# EAGLE design control (EAGLE 9.6.2)

## Sheet 1 of 3: MCU
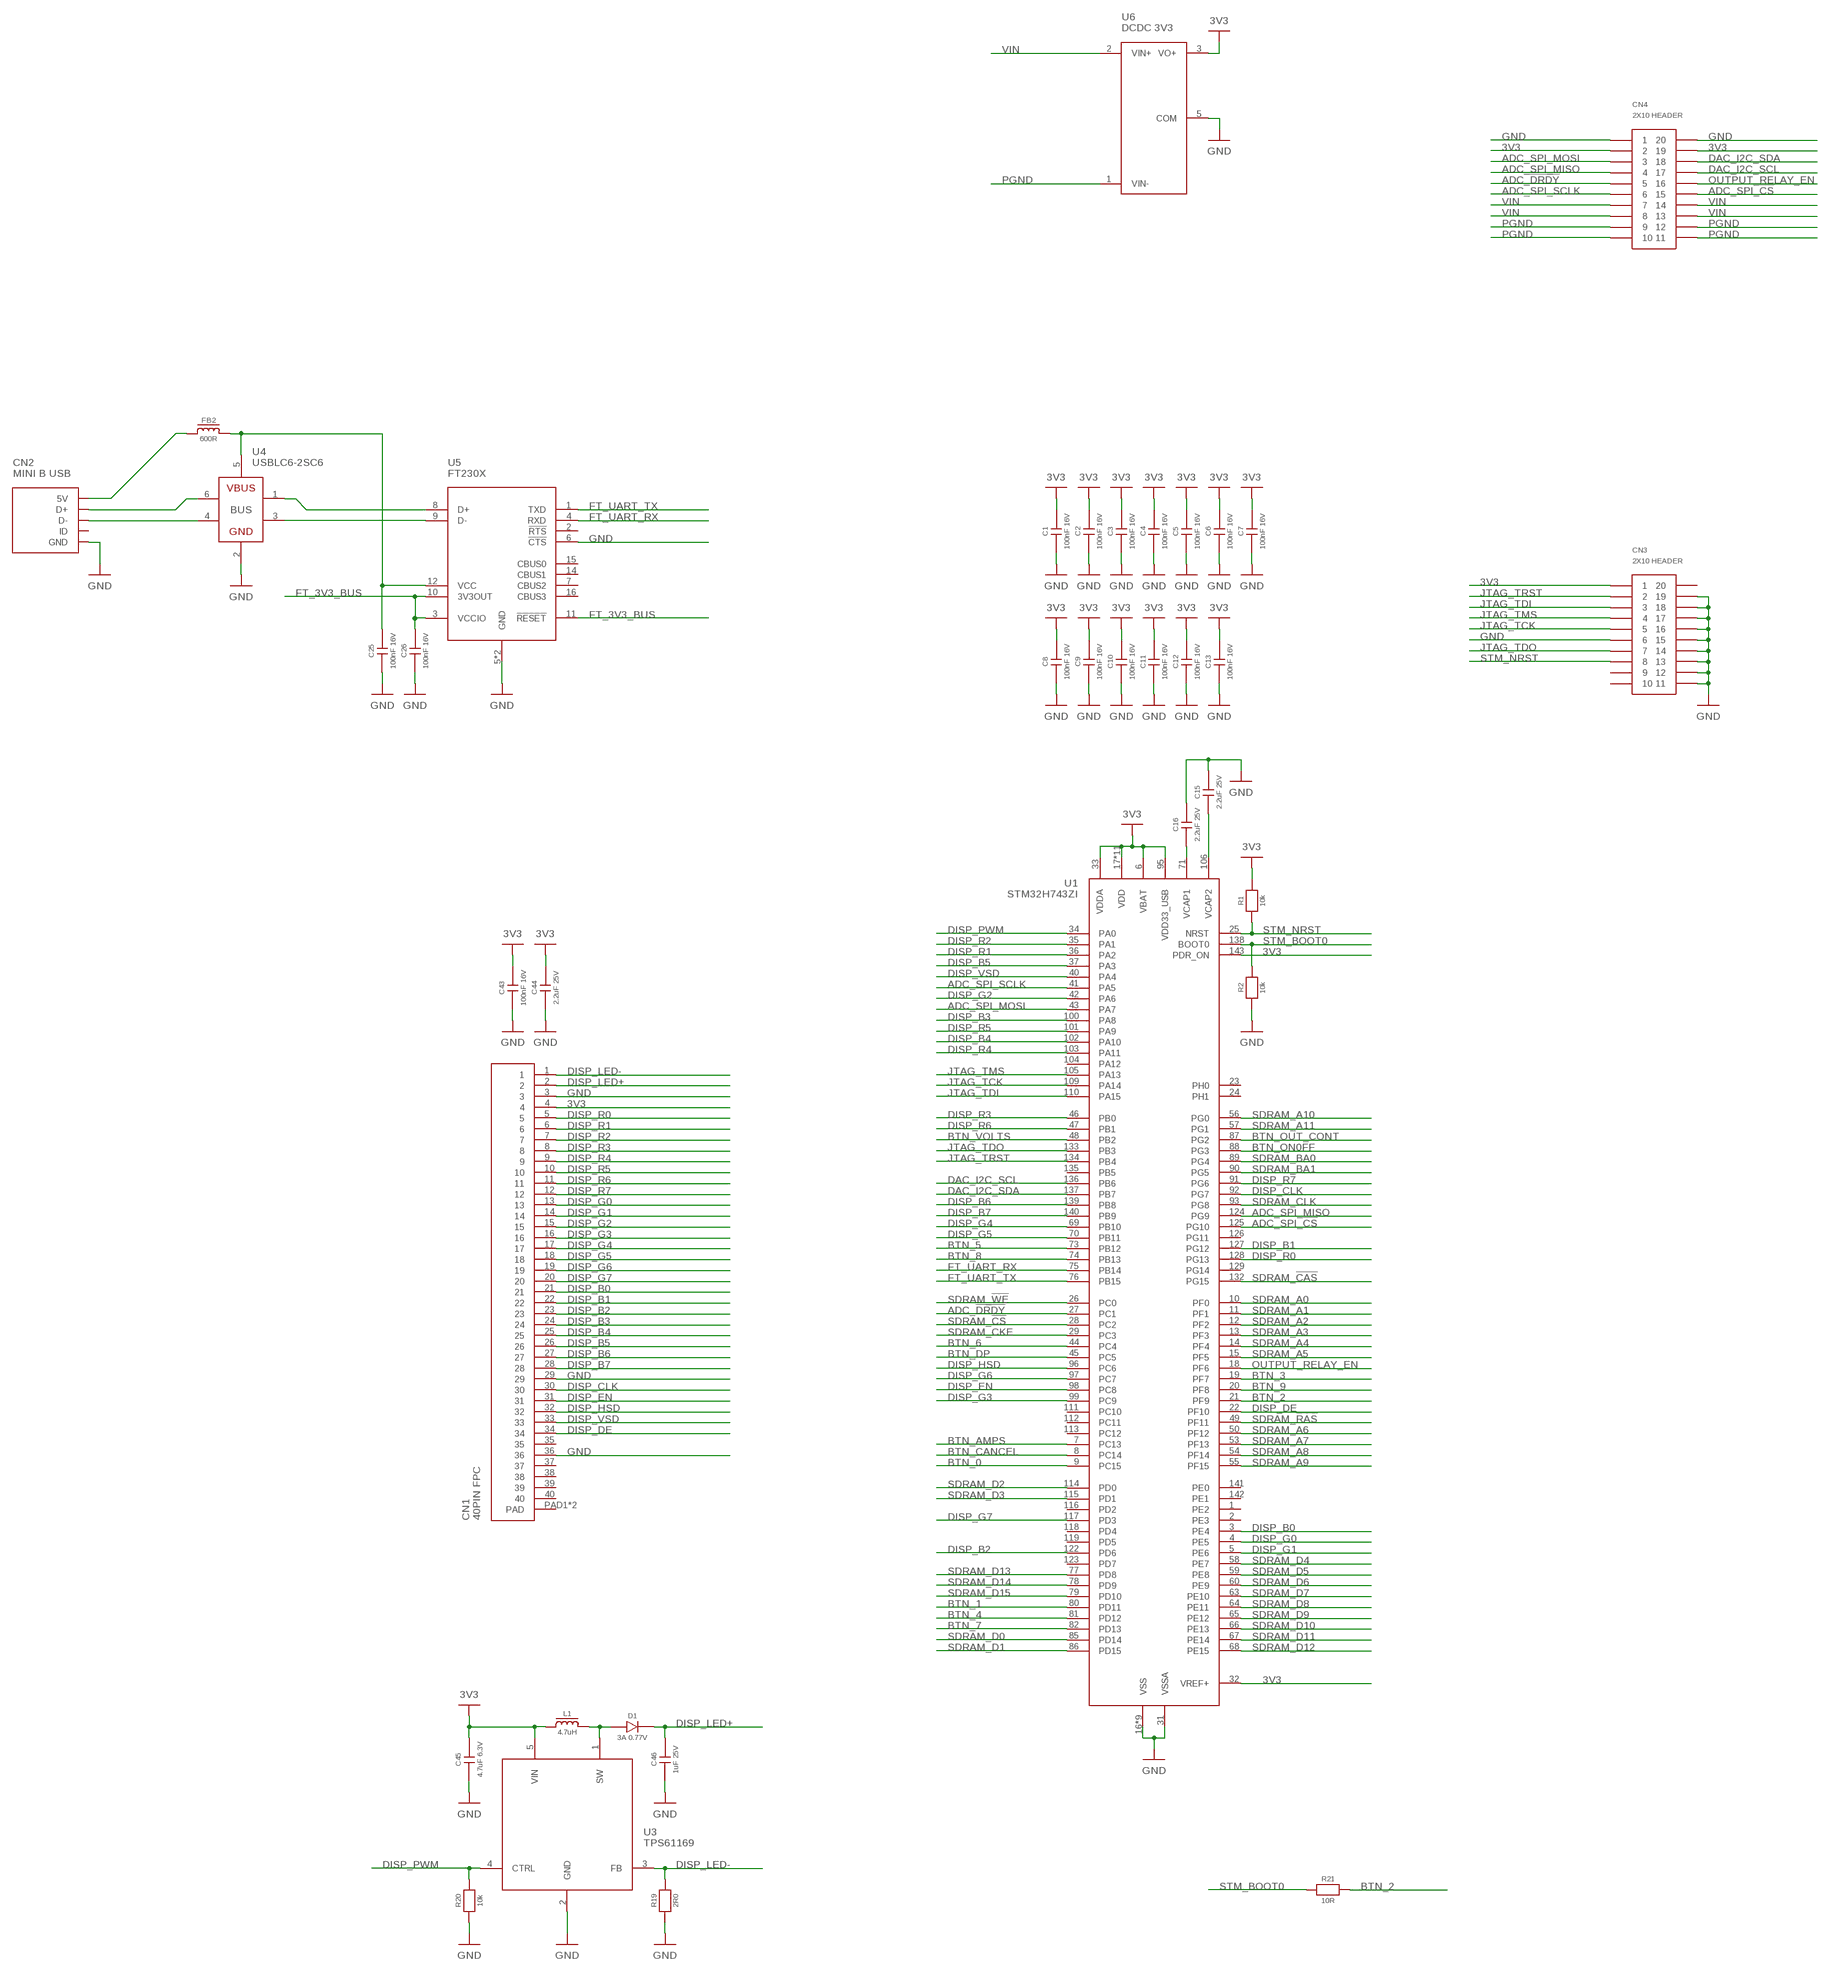
[diagram p0: schematic, sheet 1]

### Parts
C1  100nF 16V  CL10B104KO8WPNC  [0603]
C2  100nF 16V  CL10B104KO8WPNC  [0603]
C3  100nF 16V  CL10B104KO8WPNC  [0603]
C4  100nF 16V  CL10B104KO8WPNC  [0603]
C5  100nF 16V  CL10B104KO8WPNC  [0603]
C6  100nF 16V  CL10B104KO8WPNC  [0603]
C7  100nF 16V  CL10B104KO8WPNC  [0603]
C8  100nF 16V  CL10B104KO8WPNC  [0603]
C9  100nF 16V  CL10B104KO8WPNC  [0603]
C10  100nF 16V  CL10B104KO8WPNC  [0603]
C11  100nF 16V  CL10B104KO8WPNC  [0603]
C12  100nF 16V  CL10B104KO8WPNC  [0603]
C13  100nF 16V  CL10B104KO8WPNC  [0603]
C15  2.2uF 25V  GRM188R61E225KA12D  [0603]
C16  2.2uF 25V  GRM188R61E225KA12D  [0603]
C25  100nF 16V  CL10B104KO8WPNC  [0603]
C26  100nF 16V  CL10B104KO8WPNC  [0603]
C43  100nF 16V  CL10B104KO8WPNC  [0603]
C44  2.2uF 25V  GRM188R61E225KA12D  [0603]
C45  4.7uF 6.3V  CL10B475KQ8NQNC  [0603]
C46  1uF 25V  CL10A105KA8NNNC  [0603]
CN1  40PIN FPC  XF2M40151A  [XF2M40151A]
CN2  MINI B USB  MUSB-05-S-B-SM-A  [MUSB-05-S-B-SM-A]
CN3  2X10 HEADER  2X10_HEADER  [2X10PIN_HEADER]
CN4  2X10 HEADER  2X10_HEADER  [2X10PIN_HEADER]
D1  3A 0.77V  PMEG10030ELP  [SOD128]
FB2  600R  742792651  [0603]
L1  4.7uH  SRN6045TA-4R7M  [SRN6045]
R1  10k  ERJ3EKF1002V  [0603]
R2  10k  ERJ3EKF1002V  [0603]
R19  2R0  CRCW12062R00FNEA  [1206]
R20  10k  ERJ3EKF1002V  [0603]
R21  10R  ERJ3EKF10R0V  [0603]
U1  STM32H743ZI  [QFP144]
U3  TPS61169  TPS61169DCKR  [SOT23-5]
U4  USBLC6-2SC6  [SOT23-6]
U5  FT230X  FT230XS  [SSOP16-4MM]
U6  DCDC 3V3  PDQE15-Q24-S3-D  [PDQE10]

### Nets
3V3: C1.2 C2.2 C3.2 C4.2 C5.2 C6.2 C7.2 C8.2 C9.2 C10.2 C11.2 C12.2 C13.2 C43.2 C44.2 C45.2 CN1.4 CN3.1 CN4.2 CN4.19 L1.1 R1.2 U1.6(VBAT) U1.17(VDD) U1.30(VDD) U1.32(VREF+) U1.33(VDDA) U1.39(VDD) U1.52(VDD) U1.62(VDD) U1.72(VDD) U1.84(VDD) U1.95(VDD33_USB) U1.108(VDD) U1.121(VDD) U1.131(VDD) U1.143(PDR_ON) U1.144(VDD) U3.5(VIN) U6.3(VO+) ; also sheet 3
ADC_!DRDY: CN4.5 U1.27(PC1)
ADC_SPI_!CS: CN4.15 U1.125(PG10)
ADC_SPI_MISO: CN4.4 U1.124(PG9)
ADC_SPI_MOSI: CN4.3 U1.43(PA7)
ADC_SPI_SCLK: CN4.6 U1.41(PA5)
BTN_0: U1.9(PC15) ; also sheet 3
BTN_1: U1.80(PD11) ; also sheet 3
BTN_2: R21.2 U1.21(PF9) ; also sheet 3
BTN_3: U1.19(PF7) ; also sheet 3
BTN_4: U1.81(PD12) ; also sheet 3
BTN_5: U1.73(PB12) ; also sheet 3
BTN_6: U1.44(PC4) ; also sheet 3
BTN_7: U1.82(PD13) ; also sheet 3
BTN_8: U1.74(PB13) ; also sheet 3
BTN_9: U1.20(PF8) ; also sheet 3
BTN_AMPS: U1.7(PC13) ; also sheet 3
BTN_CANCEL: U1.8(PC14) ; also sheet 3
BTN_DP: U1.45(PC5) ; also sheet 3
BTN_ON0FF: U1.88(PG3) ; also sheet 3
BTN_OUT_CONT: U1.87(PG2) ; also sheet 3
BTN_VOLTS: U1.48(PB2) ; also sheet 3
DAC_I2C_SCL: CN4.17 U1.136(PB6)
DAC_I2C_SDA: CN4.18 U1.137(PB7)
DISP_B0: CN1.21 U1.3(PE4)
DISP_B1: CN1.22 U1.127(PG12)
DISP_B2: CN1.23 U1.122(PD6)
DISP_B3: CN1.24 U1.100(PA8)
DISP_B4: CN1.25 U1.102(PA10)
DISP_B5: CN1.26 U1.37(PA3)
DISP_B6: CN1.27 U1.139(PB8)
DISP_B7: CN1.28 U1.140(PB9)
DISP_CLK: CN1.30 U1.92(PG7)
DISP_DE: CN1.34 U1.22(PF10)
DISP_EN: CN1.31 U1.98(PC8)
DISP_G0: CN1.13 U1.4(PE5)
DISP_G1: CN1.14 U1.5(PE6)
DISP_G2: CN1.15 U1.42(PA6)
DISP_G3: CN1.16 U1.99(PC9)
DISP_G4: CN1.17 U1.69(PB10)
DISP_G5: CN1.18 U1.70(PB11)
DISP_G6: CN1.19 U1.97(PC7)
DISP_G7: CN1.20 U1.117(PD3)
DISP_HSD: CN1.32 U1.96(PC6)
DISP_LED+: C46.2 CN1.2 D1.K
DISP_LED-: CN1.1 R19.2 U3.3(FB)
DISP_PWM: R20.2 U1.34(PA0) U3.4(CTRL)
DISP_R0: CN1.5 U1.128(PG13)
DISP_R1: CN1.6 U1.36(PA2)
DISP_R2: CN1.7 U1.35(PA1)
DISP_R3: CN1.8 U1.46(PB0)
DISP_R4: CN1.9 U1.103(PA11)
DISP_R5: CN1.10 U1.101(PA9)
DISP_R6: CN1.11 U1.47(PB1)
DISP_R7: CN1.12 U1.91(PG6)
DISP_VSD: CN1.33 U1.40(PA4)
FT_3V3_BUS: C26.2 U5.3(VCCIO) U5.10(3V3OUT) U5.11(!RESET)
FT_UART_RX: U1.75(PB14) U5.4(RXD)
FT_UART_TX: U1.76(PB15) U5.1(TXD)
GND: C1.1 C2.1 C3.1 C4.1 C5.1 C6.1 C7.1 C8.1 C9.1 C10.1 C11.1 C12.1 C13.1 C15.2 C16.2 C25.1 C26.1 C43.1 C44.1 C45.1 C46.1 CN1.3 CN1.29 CN1.36 CN2.GND CN2.SHIELD1(GND) CN2.SHIELD2(GND) CN2.SHIELD3(GND) CN2.SHIELD4(GND) CN3.6 CN3.11 CN3.12 CN3.13 CN3.14 CN3.15 CN3.16 CN3.17 CN3.18 CN3.19 CN4.1 CN4.20 R2.1 R19.1 R20.1 U1.16(VSS) U1.31(VSSA) U1.38(VSS) U1.51(VSS) U1.61(VSS) U1.83(VSS) U1.94(VSS) U1.107(VSS) U1.120(VSS) U1.130(VSS) U3.2(GND) U4.2(GND) U5.5(GND) U5.6(!CTS) U5.13(GND) U6.5(COM) ; also sheet 3
JTAG_TCK: CN3.5 U1.109(PA14)
JTAG_TDI: CN3.3 U1.110(PA15)
JTAG_TDO: CN3.7 U1.133(PB3)
JTAG_TMS: CN3.4 U1.105(PA13)
JTAG_TRST: CN3.2 U1.134(PB4)
N$1: C16.1 U1.71(VCAP1)
N$2: C15.1 U1.106(VCAP2)
N$41: CN2.D- U4.4(D-OUT)
N$42: CN2.D+ U4.6(D+_OUT)
N$43: U4.3(D-_IN) U5.9(D-)
N$44: U4.1(D+_IN) U5.8(D+)
N$45: CN2.VCC(5V) FB2.1
N$46: C25.2 FB2.2 U4.5(VBUS) U5.12(VCC)
N$86: D1.A L1.2 U3.1(SW)
OUTPUT_RELAY_EN: CN4.16 U1.18(PF6)
PGND: CN4.9 CN4.10 CN4.11 CN4.12 U6.1(VIN-)
SDRAM_!CAS: U1.132(PG15)
SDRAM_!CS: U1.28(PC2)
SDRAM_!RAS: U1.49(PF11)
SDRAM_!WE: U1.26(PC0)
SDRAM_A0: U1.10(PF0)
SDRAM_A1: U1.11(PF1)
SDRAM_A2: U1.12(PF2)
SDRAM_A3: U1.13(PF3)
SDRAM_A4: U1.14(PF4)
SDRAM_A5: U1.15(PF5)
SDRAM_A6: U1.50(PF12)
SDRAM_A7: U1.53(PF13)
SDRAM_A8: U1.54(PF14)
SDRAM_A9: U1.55(PF15)
SDRAM_A10: U1.56(PG0)
SDRAM_A11: U1.57(PG1)
SDRAM_BA0: U1.89(PG4)
SDRAM_BA1: U1.90(PG5)
SDRAM_CKE: U1.29(PC3)
SDRAM_CLK: U1.93(PG8)
SDRAM_D0: U1.85(PD14)
SDRAM_D1: U1.86(PD15)
SDRAM_D2: U1.114(PD0)
SDRAM_D3: U1.115(PD1)
SDRAM_D4: U1.58(PE7)
SDRAM_D5: U1.59(PE8)
SDRAM_D6: U1.60(PE9)
SDRAM_D7: U1.63(PE10)
SDRAM_D8: U1.64(PE11)
SDRAM_D9: U1.65(PE12)
SDRAM_D10: U1.66(PE13)
SDRAM_D11: U1.67(PE14)
SDRAM_D12: U1.68(PE15)
SDRAM_D13: U1.77(PD8)
SDRAM_D14: U1.78(PD9)
SDRAM_D15: U1.79(PD10)
STM_BOOT0: R2.2 R21.1 U1.138(BOOT0)
STM_NRST: CN3.8 R1.1 U1.25(NRST)
VIN: CN4.7 CN4.8 CN4.13 CN4.14 U6.2(VIN+)
Unconnected: CN1.35 CN1.37 CN1.38 CN1.39 CN1.40 CN1.PAD1(PAD) CN1.PAD2(PAD) CN2.ID CN3.9 CN3.10 CN3.20 U1.1(PE2) U1.2(PE3) U1.23(PH0) U1.24(PH1) U1.104(PA12) U1.111(PC10) U1.112(PC11) U1.113(PC12) U1.116(PD2) U1.118(PD4) U1.119(PD5) U1.123(PD7) U1.126(PG11) U1.129(PG14) U1.135(PB5) U1.141(PE0) U1.142(PE1) U5.2(!RTS) U5.7(CBUS2) U5.14(CBUS1) U5.15(CBUS0) U5.16(CBUS3)

## Sheet 2 of 3: MECH
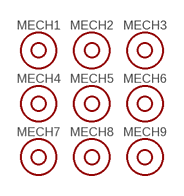
[diagram p1: schematic, sheet 2]

### Parts
MECH1  6mm x 3mm  MOUNTHOLE  [MOUNTHOLE_6X3]
MECH2  6mm x 3mm  MOUNTHOLE  [MOUNTHOLE_6X3]
MECH3  6mm x 3mm  MOUNTHOLE  [MOUNTHOLE_6X3]
MECH4  6mm x 3mm  MOUNTHOLE  [MOUNTHOLE_6X3]
MECH5  6mm x 3mm  MOUNTHOLE  [MOUNTHOLE_6X3]
MECH6  6mm x 3mm  MOUNTHOLE  [MOUNTHOLE_6X3]
MECH7  6mm x 3mm  MOUNTHOLE  [MOUNTHOLE_6X3]
MECH8  6mm x 3mm  MOUNTHOLE  [MOUNTHOLE_6X3]
MECH9  6mm x 3mm  MOUNTHOLE  [MOUNTHOLE_6X3]

## Sheet 3 of 3: BUTTONS
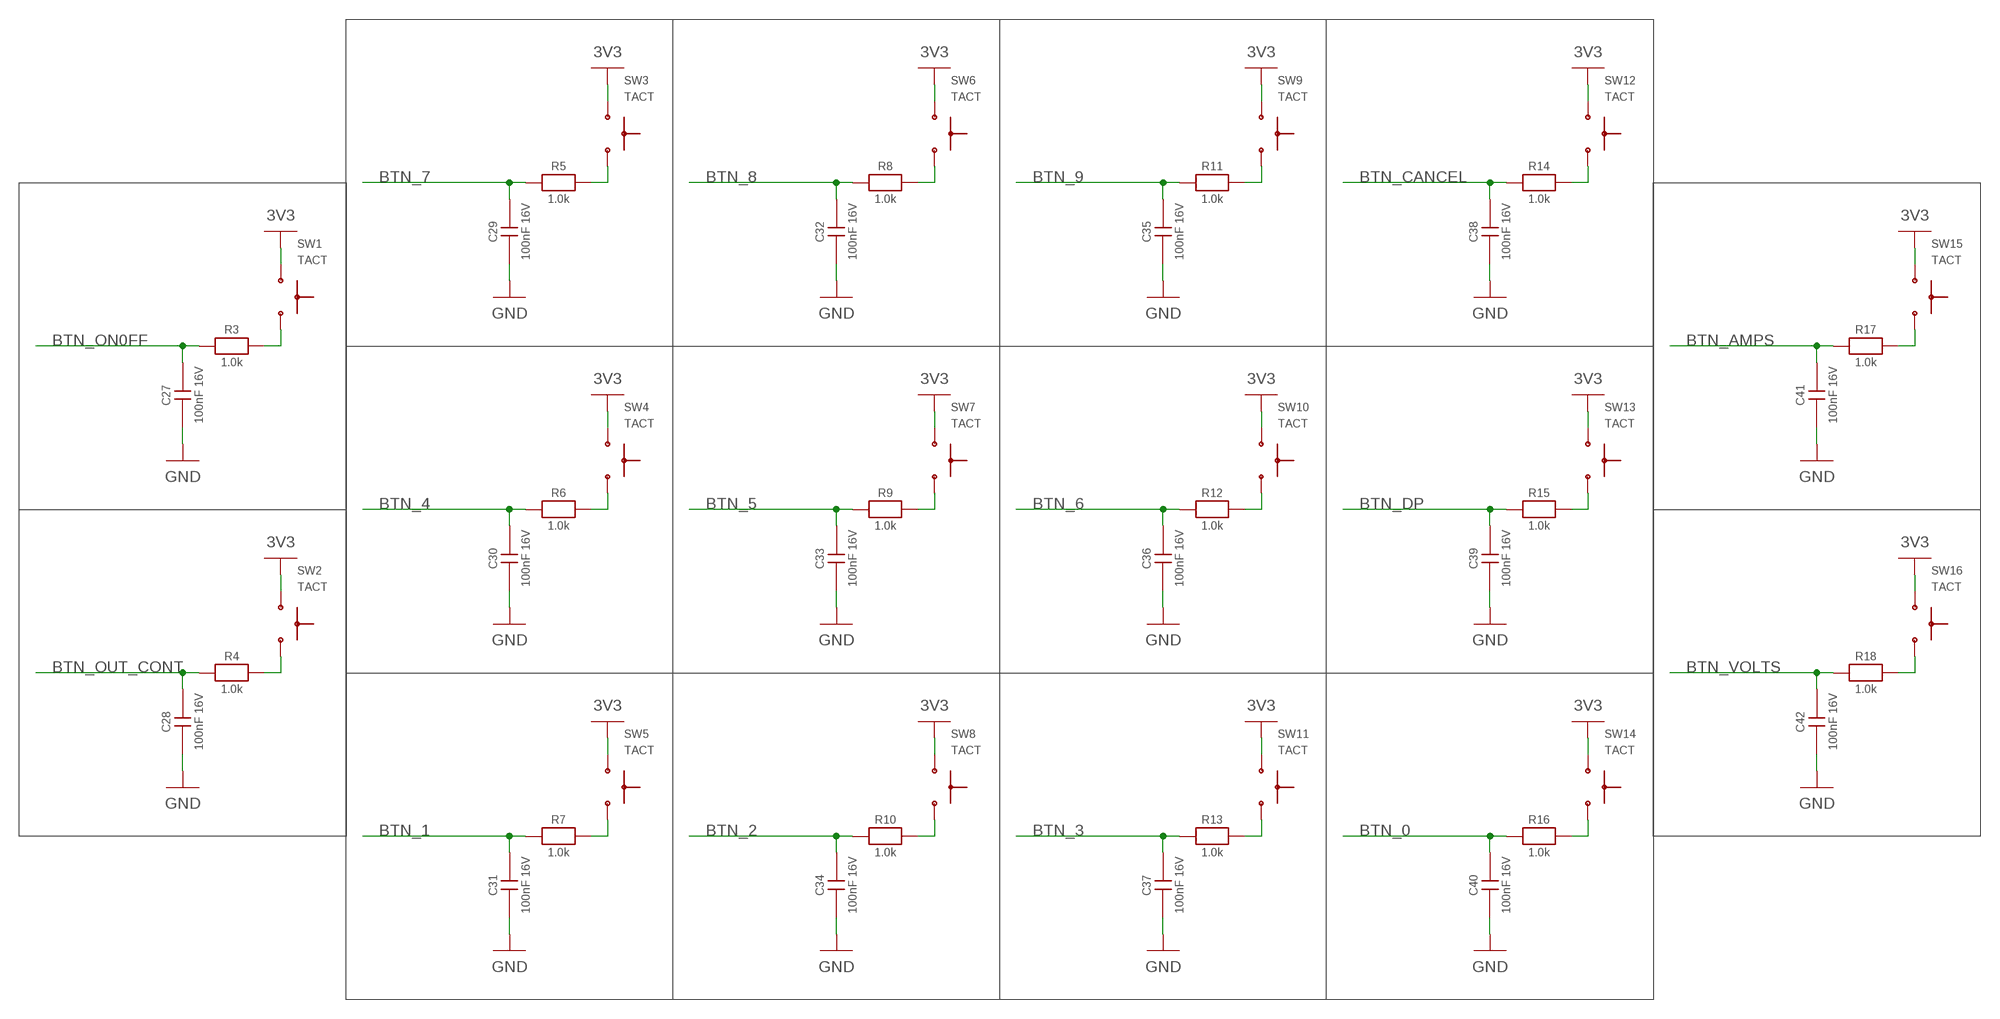
[diagram p2: schematic, sheet 3]

### Parts
C27  100nF 16V  CL10B104KO8WPNC  [0603]
C28  100nF 16V  CL10B104KO8WPNC  [0603]
C29  100nF 16V  CL10B104KO8WPNC  [0603]
C30  100nF 16V  CL10B104KO8WPNC  [0603]
C31  100nF 16V  CL10B104KO8WPNC  [0603]
C32  100nF 16V  CL10B104KO8WPNC  [0603]
C33  100nF 16V  CL10B104KO8WPNC  [0603]
C34  100nF 16V  CL10B104KO8WPNC  [0603]
C35  100nF 16V  CL10B104KO8WPNC  [0603]
C36  100nF 16V  CL10B104KO8WPNC  [0603]
C37  100nF 16V  CL10B104KO8WPNC  [0603]
C38  100nF 16V  CL10B104KO8WPNC  [0603]
C39  100nF 16V  CL10B104KO8WPNC  [0603]
C40  100nF 16V  CL10B104KO8WPNC  [0603]
C41  100nF 16V  CL10B104KO8WPNC  [0603]
C42  100nF 16V  CL10B104KO8WPNC  [0603]
R3  1.0k  ERJ3EKF1001V  [0603]
R4  1.0k  ERJ3EKF1001V  [0603]
R5  1.0k  ERJ3EKF1001V  [0603]
R6  1.0k  ERJ3EKF1001V  [0603]
R7  1.0k  ERJ3EKF1001V  [0603]
R8  1.0k  ERJ3EKF1001V  [0603]
R9  1.0k  ERJ3EKF1001V  [0603]
R10  1.0k  ERJ3EKF1001V  [0603]
R11  1.0k  ERJ3EKF1001V  [0603]
R12  1.0k  ERJ3EKF1001V  [0603]
R13  1.0k  ERJ3EKF1001V  [0603]
R14  1.0k  ERJ3EKF1001V  [0603]
R15  1.0k  ERJ3EKF1001V  [0603]
R16  1.0k  ERJ3EKF1001V  [0603]
R17  1.0k  ERJ3EKF1001V  [0603]
R18  1.0k  ERJ3EKF1001V  [0603]
SW1  TACT  TL1100DF160Q  [TL1100DF160Q]
SW2  TACT  TL1100DF160Q  [TL1100DF160Q]
SW3  TACT  TL1100DF160Q  [TL1100DF160Q]
SW4  TACT  TL1100DF160Q  [TL1100DF160Q]
SW5  TACT  TL1100DF160Q  [TL1100DF160Q]
SW6  TACT  TL1100DF160Q  [TL1100DF160Q]
SW7  TACT  TL1100DF160Q  [TL1100DF160Q]
SW8  TACT  TL1100DF160Q  [TL1100DF160Q]
SW9  TACT  TL1100DF160Q  [TL1100DF160Q]
SW10  TACT  TL1100DF160Q  [TL1100DF160Q]
SW11  TACT  TL1100DF160Q  [TL1100DF160Q]
SW12  TACT  TL1100DF160Q  [TL1100DF160Q]
SW13  TACT  TL1100DF160Q  [TL1100DF160Q]
SW14  TACT  TL1100DF160Q  [TL1100DF160Q]
SW15  TACT  TL1100DF160Q  [TL1100DF160Q]
SW16  TACT  TL1100DF160Q  [TL1100DF160Q]

### Nets
3V3: SW1.1 SW1.3 SW2.1 SW2.3 SW3.1 SW3.3 SW4.1 SW4.3 SW5.1 SW5.3 SW6.1 SW6.3 SW7.1 SW7.3 SW8.1 SW8.3 SW9.1 SW9.3 SW10.1 SW10.3 SW11.1 SW11.3 SW12.1 SW12.3 SW13.1 SW13.3 SW14.1 SW14.3 SW15.1 SW15.3 SW16.1 SW16.3 ; also sheet 1
BTN_0: C40.2 R16.1 ; also sheet 1
BTN_1: C31.2 R7.1 ; also sheet 1
BTN_2: C34.2 R10.1 ; also sheet 1
BTN_3: C37.2 R13.1 ; also sheet 1
BTN_4: C30.2 R6.1 ; also sheet 1
BTN_5: C33.2 R9.1 ; also sheet 1
BTN_6: C36.2 R12.1 ; also sheet 1
BTN_7: C29.2 R5.1 ; also sheet 1
BTN_8: C32.2 R8.1 ; also sheet 1
BTN_9: C35.2 R11.1 ; also sheet 1
BTN_AMPS: C41.2 R17.1 ; also sheet 1
BTN_CANCEL: C38.2 R14.1 ; also sheet 1
BTN_DP: C39.2 R15.1 ; also sheet 1
BTN_ON0FF: C27.2 R3.1 ; also sheet 1
BTN_OUT_CONT: C28.2 R4.1 ; also sheet 1
BTN_VOLTS: C42.2 R18.1 ; also sheet 1
GND: C27.1 C28.1 C29.1 C30.1 C31.1 C32.1 C33.1 C34.1 C35.1 C36.1 C37.1 C38.1 C39.1 C40.1 C41.1 C42.1 ; also sheet 1
N$48: R3.2 SW1.2 SW1.4
N$50: R4.2 SW2.2 SW2.4
N$52: R5.2 SW3.2 SW3.4
N$54: R6.2 SW4.2 SW4.4
N$56: R7.2 SW5.2 SW5.4
N$58: R8.2 SW6.2 SW6.4
N$60: R9.2 SW7.2 SW7.4
N$62: R10.2 SW8.2 SW8.4
N$64: R11.2 SW9.2 SW9.4
N$66: R12.2 SW10.2 SW10.4
N$68: R13.2 SW11.2 SW11.4
N$70: R14.2 SW12.2 SW12.4
N$72: R15.2 SW13.2 SW13.4
N$74: R16.2 SW14.2 SW14.4
N$76: R17.2 SW15.2 SW15.4
N$78: R18.2 SW16.2 SW16.4

## Library data of the parts
C1-C13 C25-C43 = CAPACITORS:CL10B104KO8WPNC: 100nF 16V X7R 10% 0603 MLCC; DIGIKEY: 1276-6582-1-ND; HEIGHT: 1; PRICE_PER: 0.08
C15 C16 C44 = CAPACITORS:GRM188R61E225KA12D: 2.2uF 25V X5R 10% 0603 MLCC.; DIGIKEY: 490-10731-1-ND; HEIGHT: 1; PRICE_PER: 0.14
C45 = CAPACITORS:CL10B475KQ8NQNC: 4.7uF 6.3V X7R 10% 0603 MLCC.; DIGIKEY: CL10B475KQ8NQNC; HEIGHT: 1; PRICE_PER: 013
C46 = CAPACITORS:CL10A105KA8NNNC: 1uF 25V X5R 10% 0603 MLCC.; DIGIKEY: 1276-1102-1-ND; HEIGHT: 1; PRICE_PER: 0.08
CN1 = CONNECTORs:XF2M40151A: FFC / FPC Board Connector, ZIF, Surface Mount, Plug, 40 Contacts, Top, Bottom, 0.5 mm; DIGIKEY: OR729CT-ND; HEIGHT: 2; PRICE_PER: 2.07
CN2 = CONNECTORs:MUSB-05-S-B-SM-A: 5 pin, SMD, mini USB connector.; DIGIKEY: SAM8841-ND; HEIGHT: 4; PRICE_PER: 1.11
CN3 CN4 = CONNECTORs:2X10_HEADER: A 2 row, 10 column, 20 pin 0.1" header.; DIGIKEY: 2057-PH2-20-UA-ND; HEIGHT: 10; PRICE_PER: 0.2
D1 = DIODES:PMEG10030ELP: Schottky Rectifier, 100 V, 3 A, Single, SOD-128, 2 Pins, 770 mV; DIGIKEY: 1727-2397-1-ND; HEIGHT: 3; PRICE_PER: 0.37
FB2 = INDUCTORS:742792651: Ferrite Bead 600R at 100MHz 0603.; DIGIKEY: 732-1593-1-ND; HEIGHT: 1; PRICE_PER: 0.13
L1 = INDUCTORS:SRN6045TA-4R7M: Surface Mount Power Inductor, AEC-Q200, SRN6045TA Series, 4.7 µH, 4.5 A, 6.8 A, Semishielded; DIGIKEY: SRN6045TA-4R7MCT-ND; HEIGHT: 5; PRICE_PER: 0.44
MECH1-MECH9 = MISC:MOUNTHOLE: Mechanical mounting hole.
R1 R2 R20 = r_0603:ERJ3EKF1002V: 10000 10k 0603 0.1W 1% thick film resistor.; DIGIKEY: P10.0KHCT-ND; PRICE_PER: 0.10000
R3-R18 = r_0603:ERJ3EKF1001V: 1000 1.0k 0603 0.1W 1% thick film resistor.; DIGIKEY: P1.00KHCT-ND; PRICE_PER: 0.10000
R19 = RESISTORS:CRCW12062R00FNEA: 2 2R0 1206 0.25W 1% thick film resistor; DIGIKEY: 311-2.0ERCT-ND; HEIGHT: 0.65; PRICE_PER: 0.09
R21 = r_0603:ERJ3EKF10R0V: 10 10R 0603 0.1W 1% thick film resistor.; DIGIKEY: P10.0HCT-ND; PRICE_PER: 0.10000
SW1-SW16 = ELECTROMECH:TL1100DF160Q: Tactile Switch SPST-NO Top Actuated Through Hole; DIGIKEY: EG1023-ND; HEIGHT: 4.3; PRICE_PER: 0.35
U1 = ICs:STM32H743ZI: ARM® Cortex®-M7 STM32H7 Microcontroller IC 32-Bit 480MHz 2MB (2M x 8) FLASH 144-LQFP (20x20); DIGIKEY: 497-17721-ND; HEIGHT: 2; PRICE_PER: 11.56
U3 = ICs:TPS61169: 9 38-V High Current-Boost WLED Driver with PWM Control; DIGIKEY: 296-40821-1-ND; HEIGHT: 2; PRICE_PER: 0.7
U4 = ICs:USBLC6-2SC6: Very low capacitance ESD protection; DIGIKEY: 497-11882-1-ND; HEIGHT: 1.5; PRICE_PER: 0.38
U5 = ICs:FT230X: FTDI FT230XS USB Interface, Transceiver, USB 2.0, 2.97 V, 5.5 V, SSOP, 16; DIGIKEY: 768-1135-1-ND; HEIGHT: 1.5; PRICE_PER: 1.65
U6 = ICs:PDQE15-Q24-S3-D: Isolated Module DC DC Converter 1 Output 3.3V 4A 9V - 36V Input; DIGIKEY: 102-6252-ND; HEIGHT: 12; PRICE_PER: 14.88

## Board
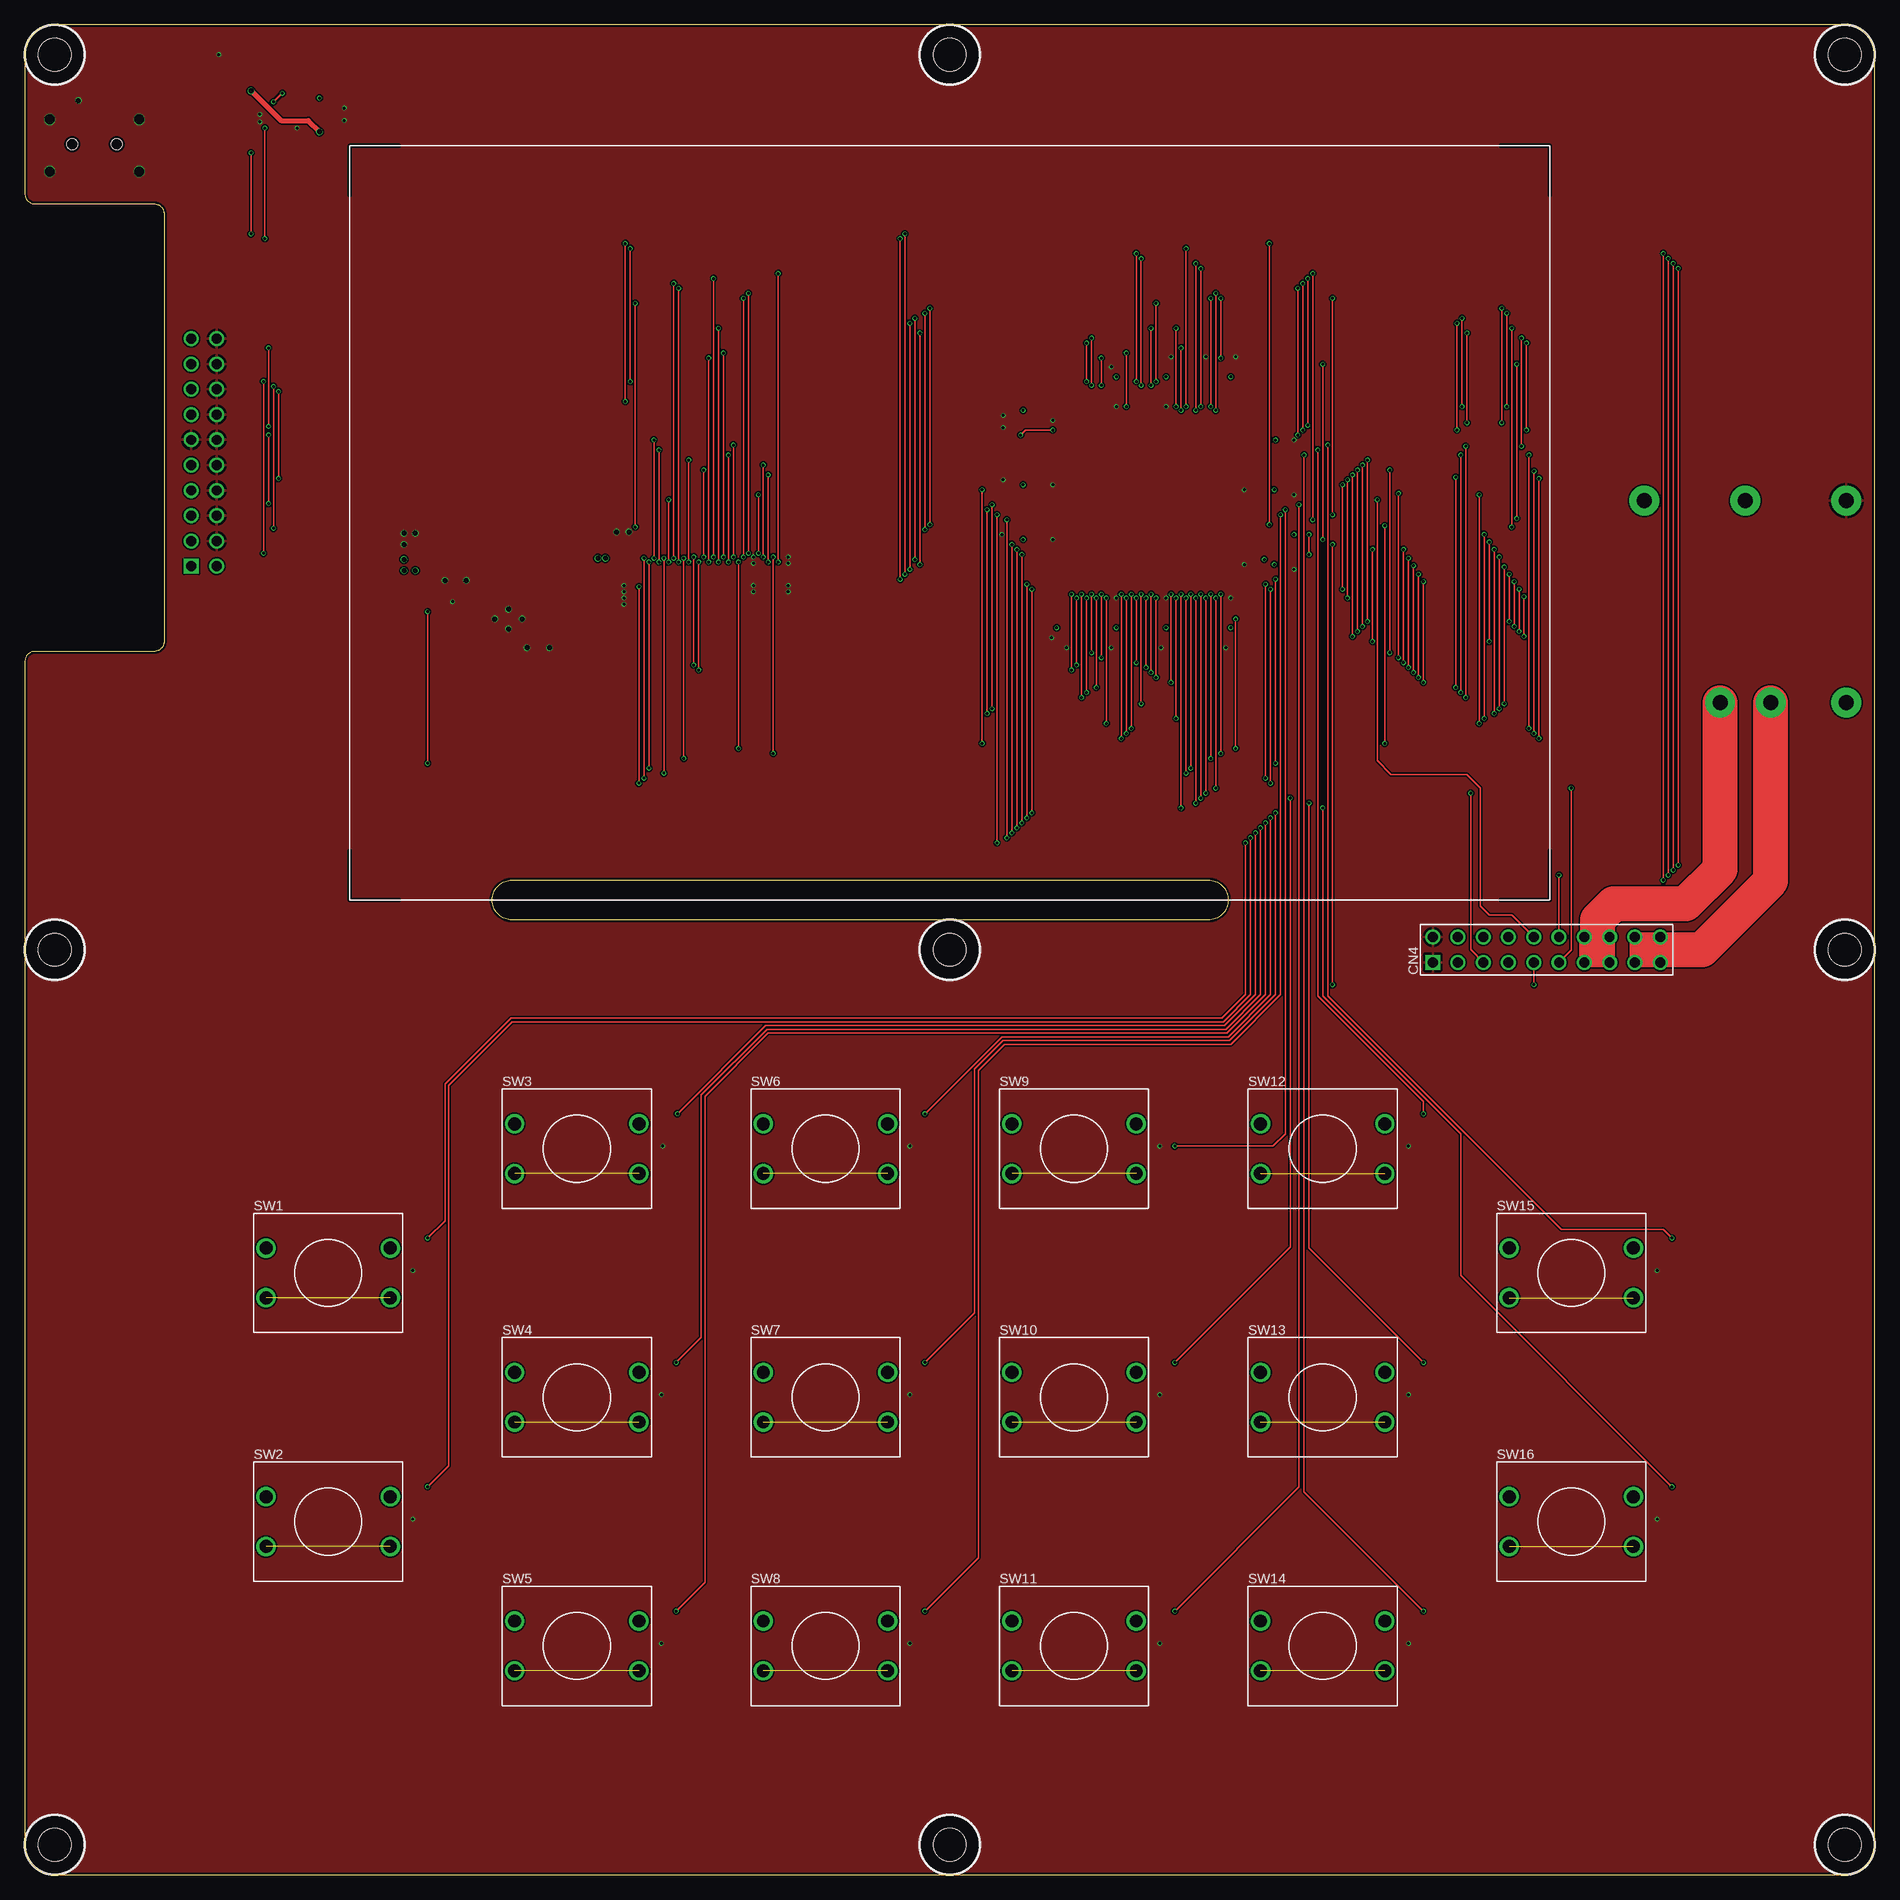
[diagram p3: board, top side]
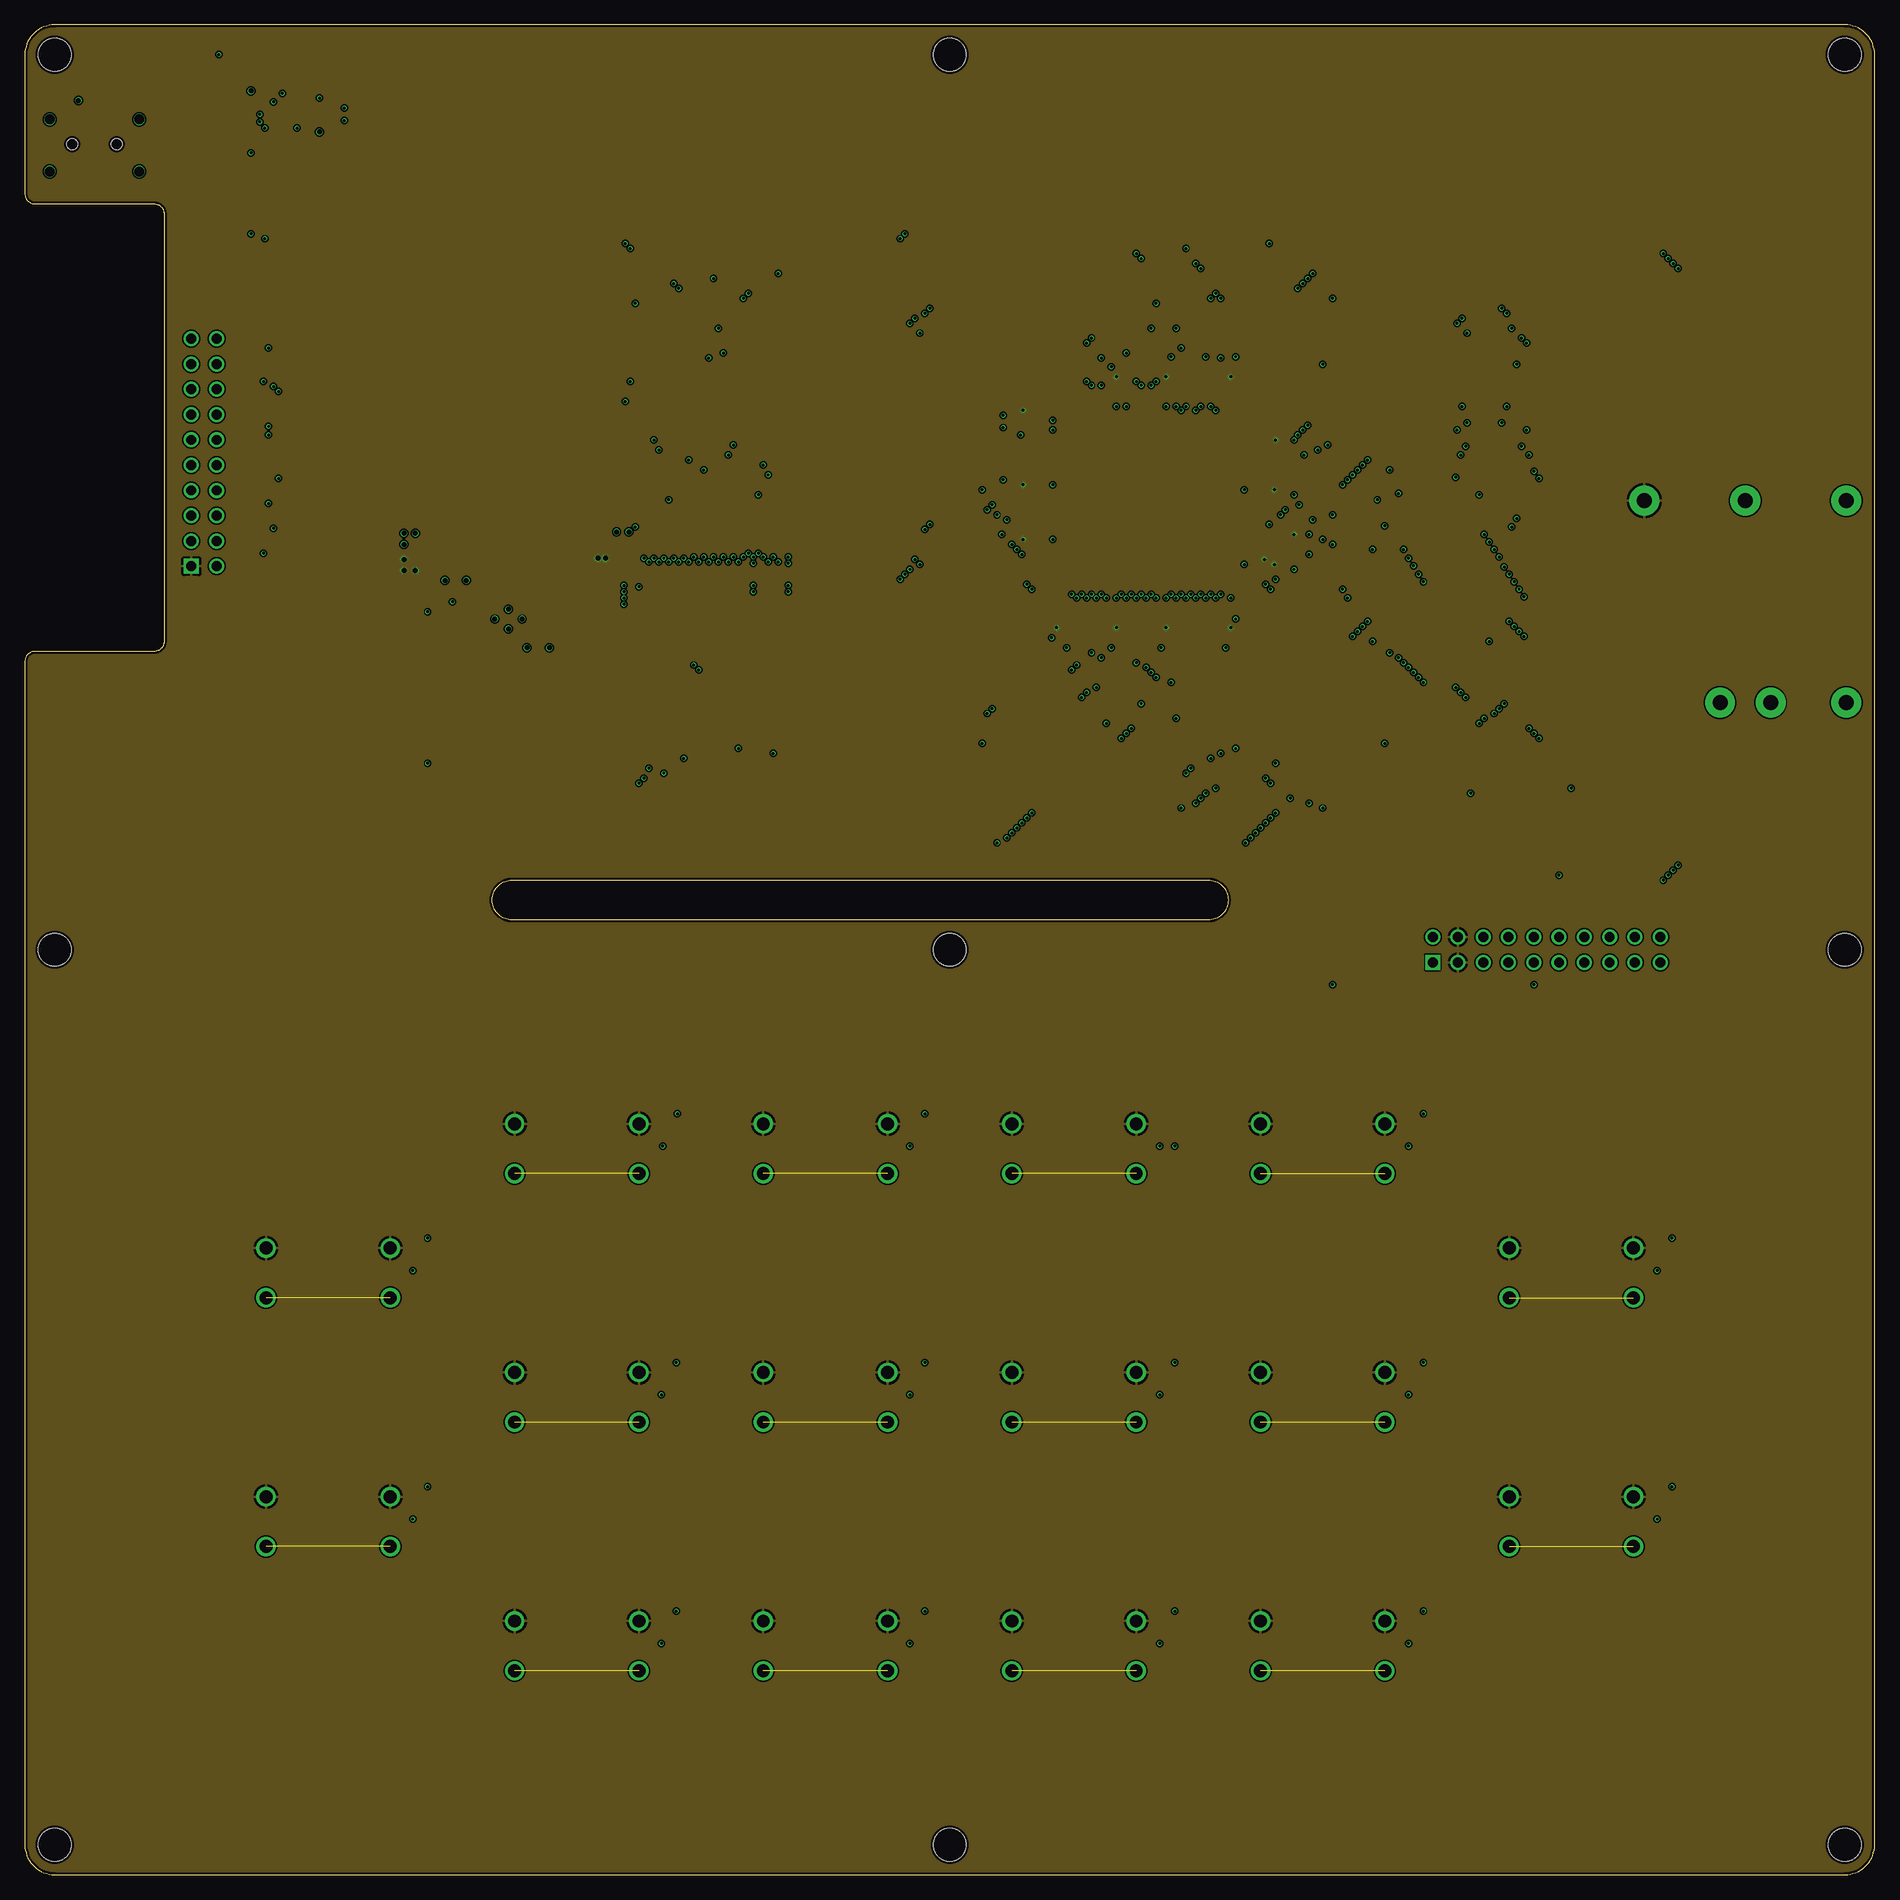
[diagram p4: board, inner layer 3V3]
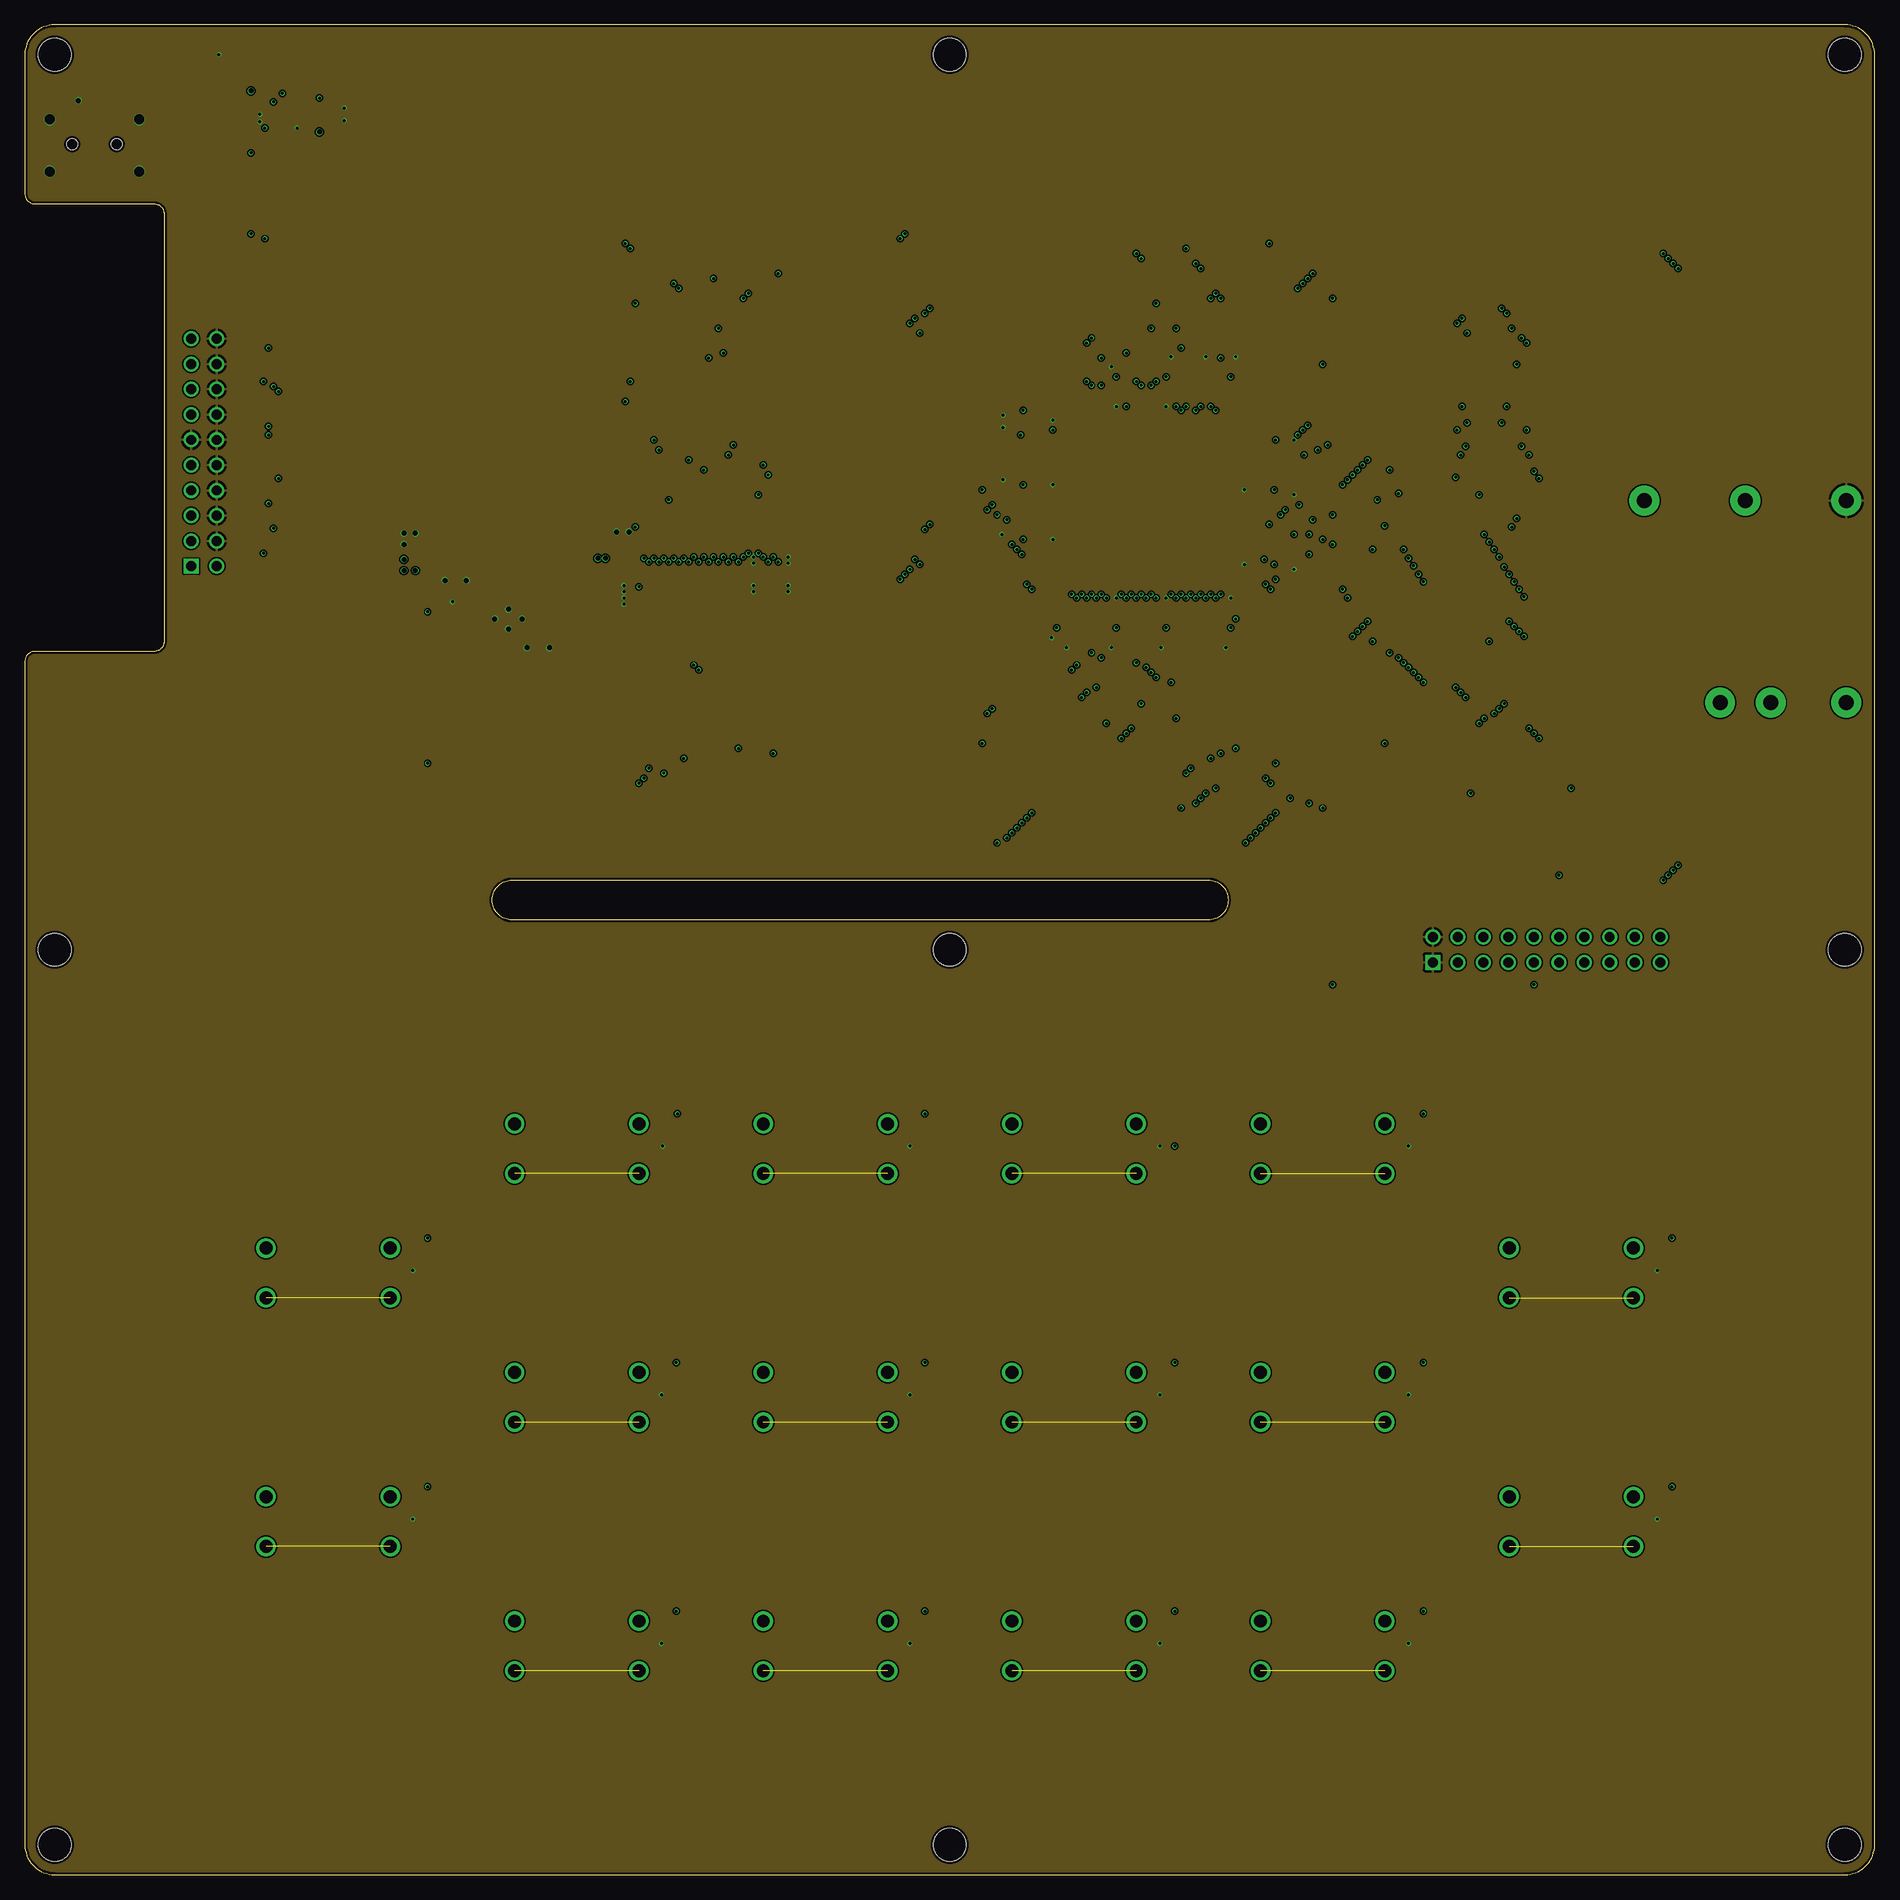
[diagram p5: board, inner layer GND]
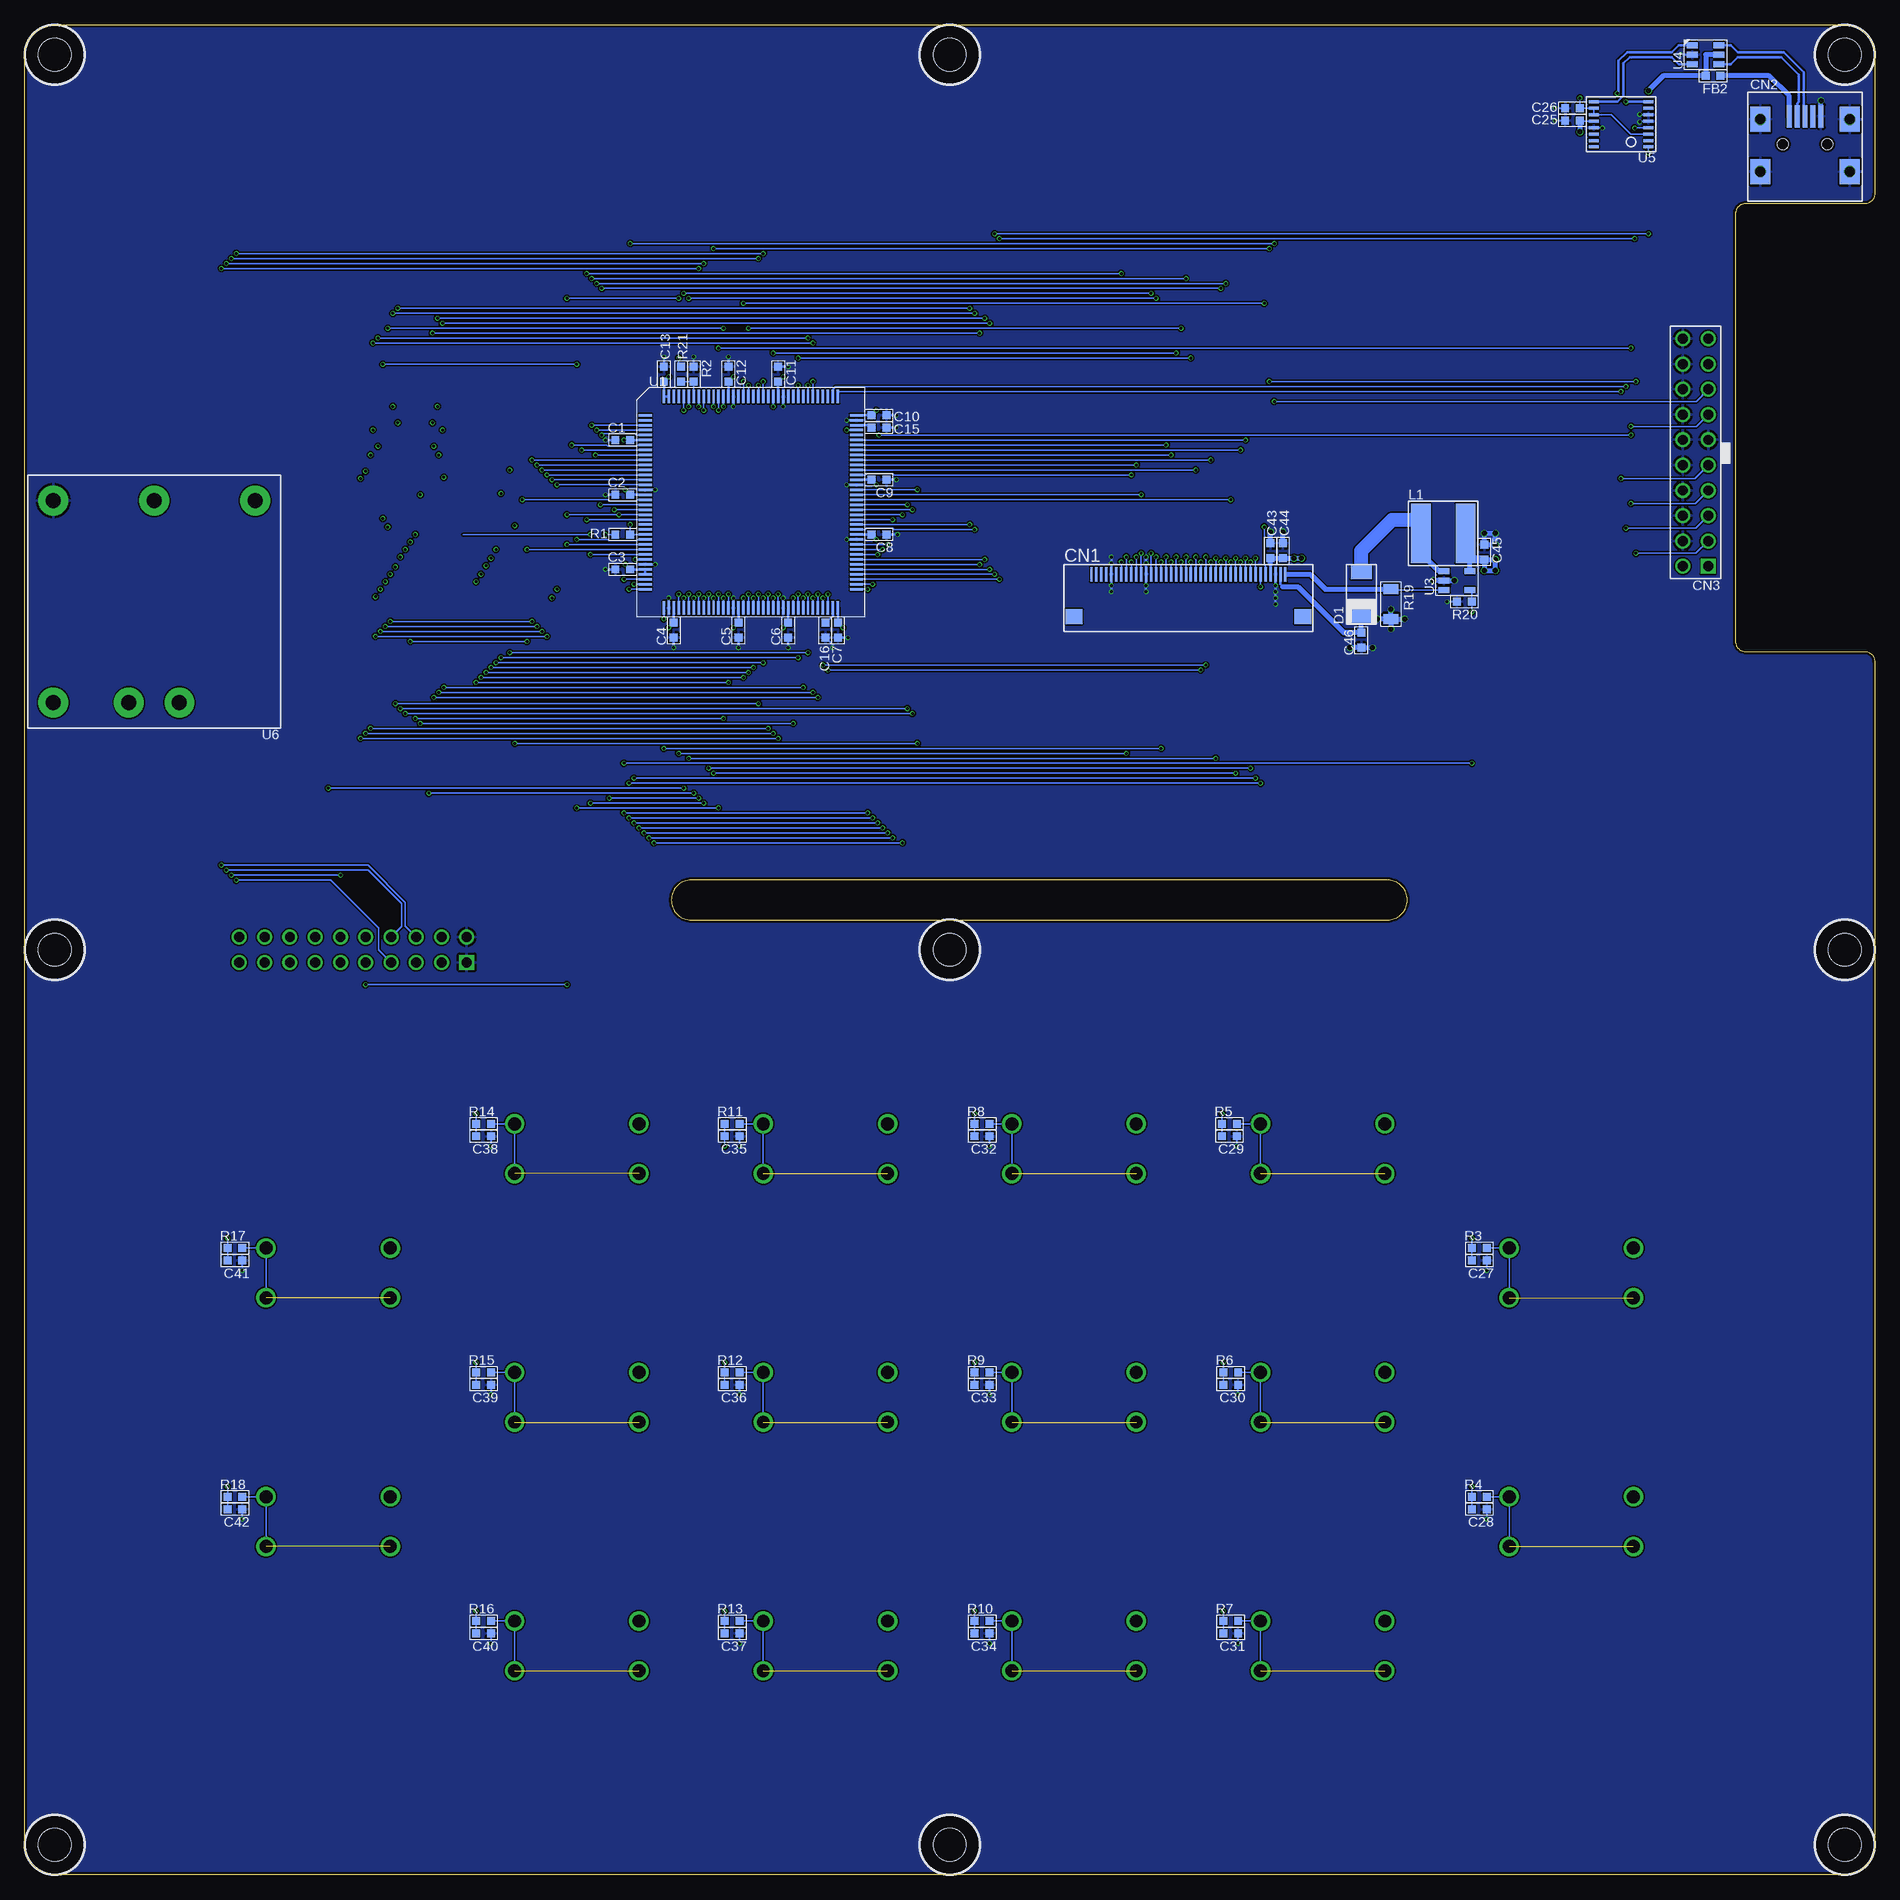
[diagram p6: board, bottom side, seen from below]

Size 186 x 186 mm. Coordinates in mm from the lower left corner, seen from the top.
Outline: 183,0 arc90 186,3 186,183 arc90 183,186 3,186 arc90 0,183 0,169 arc90 1,168 13,168 arc-90 14,167 14,124 arc-90 13,123 1,123 arc90 0,122 0,3 arc90 3,0 183,0
Outline: 119,96 49,96 arc-90 47,98 arc-90 49,100 119,100 arc-90 121,98 arc-90 119,96
Copper layers (1*2*3*16): Top 0.035mm / dielectric 0.15mm / 3V3 0.035mm / dielectric 1.11mm / GND 0.035mm / dielectric 0.2mm / Bottom 0.035mm
Design rules "myDRC 4 layers 0.15mm *": minimum track width 0.15mm, minimum drill 0.25mm, track to track 0.15mm, track to pad 0.15mm, pad to pad 0.15mm, via to via 0.15mm, smd to smd 0mil, copper to edge 0.25mm, drill to drill 0.25mm, minimum pad ring 10mil, minimum via ring 3mil, stop-mask expansion 4mil, vias tented up to drill 1mm, thermal gap 10mil

### Footprints (pad centres in the part's own frame; a part is rotated, then mirrored left to right if it is on the bottom)
0603 = smd 0.8 x 0.8: 1 -0.75,0; 2 0.75,0
XF2M40151A = smd 0.25 x 1.5: 1 9.75,2.75; 2 9.25,2.75; 3 8.75,2.75; 4 8.25,2.75; 5 7.75,2.75; 6 7.25,2.75; 7 6.75,2.75; 8 6.25,2.75; 9 5.75,2.75; 10 5.25,2.75; 11 4.75,2.75; 12 4.25,2.75; 13 3.75,2.75; 14 3.25,2.75; 15 2.75,2.75; 16 2.25,2.75; 17 1.75,2.75; 18 1.25,2.75; 19 0.75,2.75; 20 0.25,2.75; 21 -0.25,2.75; 22 -0.75,2.75; 23 -1.25,2.75; 24 -1.75,2.75; 25 -2.25,2.75; 26 -2.75,2.75; 27 -3.25,2.75; 28 -3.75,2.75; 29 -4.25,2.75; 30 -4.75,2.75; 31 -5.25,2.75; 32 -5.75,2.75; 33 -6.25,2.75; 34 -6.75,2.75; 35 -7.25,2.75; 36 -7.75,2.75; 37 -8.25,2.75; 38 -8.75,2.75; 39 -9.25,2.75; 40 -9.75,2.75 | smd 1.7 x 1.5: PAD1 -11.5,-1.5; PAD2 11.5,-1.5
MUSB-05-S-B-SM-A = smd 0.5 x 2.25: D+ 0,2.8; D- -0.8,2.8; GND 1.6,2.8; ID 0.8,2.8; VCC -1.6,2.8 | smd 2 x 2.5: SHIELD1 -4.5,2.5; SHIELD2 4.5,2.5; SHIELD3 4.5,-2.75; SHIELD4 -4.5,-2.75 | hole 1.1: 2.25,0; -2.25,0
2X10PIN_HEADER = drill 1 pad 1.5 square: 1 -1.27,11.43 | drill 1 pad 1.5: 2 -1.27,8.89; 3 -1.27,6.35; 4 -1.27,3.81; 5 -1.27,1.27; 6 -1.27,-1.27; 7 -1.27,-3.81; 8 -1.27,-6.35; 9 -1.27,-8.89; 10 -1.27,-11.43; 11 1.27,-11.43; 12 1.27,-8.89; 13 1.27,-6.35; 14 1.27,-3.81; 15 1.27,-1.27; 16 1.27,1.27; 17 1.27,3.81; 18 1.27,6.35; 19 1.27,8.89; 20 1.27,11.43
SOD128 = smd 1.4 x 2.1: A -2.2,0; K 2.2,0
SRN6045 = smd 2 x 6: 1 -2.25,0; 2 2.25,0
MOUNTHOLE_6X3 = hole 3.3: 0,0
1206 = smd 1 x 1.5: 1 1.5,0; 2 -1.5,0
TL1100DF160Q = drill 1.3: 1 -6.25,2.5; 2 -6.25,-2.5; 3 6.25,2.5; 4 6.25,-2.5
QFP144 = smd 1.35 x 0.25: 1 -10.625,8.75; 2 -10.625,8.25; 3 -10.625,7.75; 4 -10.625,7.25; 5 -10.625,6.75; 6 -10.625,6.25; 7 -10.625,5.75; 8 -10.625,5.25; 9 -10.625,4.75; 10 -10.625,4.25; 11 -10.625,3.75; 12 -10.625,3.25; 13 -10.625,2.75; 14 -10.625,2.25; 15 -10.625,1.75; 16 -10.625,1.25; 17 -10.625,0.75; 18 -10.625,0.25; 19 -10.625,-0.25; 20 -10.625,-0.75; 21 -10.625,-1.25; 22 -10.625,-1.75; 23 -10.625,-2.25; 24 -10.625,-2.75; 25 -10.625,-3.25; 26 -10.625,-3.75; 27 -10.625,-4.25; 28 -10.625,-4.75; 29 -10.625,-5.25; 30 -10.625,-5.75; 31 -10.625,-6.25; 32 -10.625,-6.75; 33 -10.625,-7.25; 34 -10.625,-7.75; 35 -10.625,-8.25; 36 -10.625,-8.75; 73 10.625,-8.75; 74 10.625,-8.25; 75 10.625,-7.75; 76 10.625,-7.25; 77 10.625,-6.75; 78 10.625,-6.25; 79 10.625,-5.75; 80 10.625,-5.25; 81 10.625,-4.75; 82 10.625,-4.25; 83 10.625,-3.75; 84 10.625,-3.25; 85 10.625,-2.75; 86 10.625,-2.25; 87 10.625,-1.75; 88 10.625,-1.25; 89 10.625,-0.75; 90 10.625,-0.25; 91 10.625,0.25; 92 10.625,0.75; 93 10.625,1.25; 94 10.625,1.75; 95 10.625,2.25; 96 10.625,2.75; 97 10.625,3.25; 98 10.625,3.75; 99 10.625,4.25; 100 10.625,4.75; 101 10.625,5.25; 102 10.625,5.75; 103 10.625,6.25; 104 10.625,6.75; 105 10.625,7.25; 106 10.625,7.75; 107 10.625,8.25; 108 10.625,8.75 | smd 0.25 x 1.35: 37 -8.75,-10.625; 38 -8.25,-10.625; 39 -7.75,-10.625; 40 -7.25,-10.625; 41 -6.75,-10.625; 42 -6.25,-10.625; 43 -5.75,-10.625; 44 -5.25,-10.625; 45 -4.75,-10.625; 46 -4.25,-10.625; 47 -3.75,-10.625; 48 -3.25,-10.625; 49 -2.75,-10.625; 50 -2.25,-10.625; 51 -1.75,-10.625; 52 -1.25,-10.625; 53 -0.75,-10.625; 54 -0.25,-10.625; 55 0.25,-10.625; 56 0.75,-10.625; 57 1.25,-10.625; 58 1.75,-10.625; 59 2.25,-10.625; 60 2.75,-10.625; 61 3.25,-10.625; 62 3.75,-10.625; 63 4.25,-10.625; 64 4.75,-10.625; 65 5.25,-10.625; 66 5.75,-10.625; 67 6.25,-10.625; 68 6.75,-10.625; 69 7.25,-10.625; 70 7.75,-10.625; 71 8.25,-10.625; 72 8.75,-10.625; 109 8.75,10.625; 110 8.25,10.625; 111 7.75,10.625; 112 7.25,10.625; 113 6.75,10.625; 114 6.25,10.625; 115 5.75,10.625; 116 5.25,10.625; 117 4.75,10.625; 118 4.25,10.625; 119 3.75,10.625; 120 3.25,10.625; 121 2.75,10.625; 122 2.25,10.625; 123 1.75,10.625; 124 1.25,10.625; 125 0.75,10.625; 126 0.25,10.625; 127 -0.25,10.625; 128 -0.75,10.625; 129 -1.25,10.625; 130 -1.75,10.625; 131 -2.25,10.625; 132 -2.75,10.625; 133 -3.25,10.625; 134 -3.75,10.625; 135 -4.25,10.625; 136 -4.75,10.625; 137 -5.25,10.625; 138 -5.75,10.625; 139 -6.25,10.625; 140 -6.75,10.625; 141 -7.25,10.625; 142 -7.75,10.625; 143 -8.25,10.625; 144 -8.75,10.625
SOT23-5 = smd 0.6 x 1.1: 1 0.95,1.3; 2 0,1.3; 3 -0.95,1.3; 4 -0.95,-1.3; 5 0.95,-1.3
SOT23-6 = smd 0.6 x 1.1: 1 0.95,1.35; 2 0,1.35; 3 -0.95,1.35; 4 -0.95,-1.35; 5 0,-1.35; 6 0.95,-1.35
SSOP16-4MM = smd 1 x 0.3: 1 -2.75,2.275; 2 -2.75,1.625; 3 -2.75,0.975; 4 -2.75,0.325; 5 -2.75,-0.325; 6 -2.75,-0.975; 7 -2.75,-1.625; 8 -2.75,-2.275; 9 2.75,-2.275; 10 2.75,-1.625; 11 2.75,-0.975; 12 2.75,-0.325; 13 2.75,0.325; 14 2.75,0.975; 15 2.75,1.625; 16 2.75,2.275
PDQE10 = drill 1.5 pad 3: 1 2.54,10.16; 2 -2.54,10.16; 3 -10.16,-10.16; 4 0,-10.16; 5 10.16,-10.16; 6 10.16,10.16

### Placement (x,y rotation side)
C1  125.88,144.25 0 bottom
C2  125.88,138.75 0 bottom
C3  125.88,131.25 0 bottom
C4  120.75,125.12 90 bottom
C5  114.25,125.12 90 bottom
C6  109.25,125.12 90 bottom
C7  104.25,125.12 90 bottom
C8  100.12,134.75 180 bottom
C9  100.12,140.25 180 bottom
C10  100.12,146.75 180 bottom
C11  110.25,150.88 270 bottom
C12  115.25,150.88 270 bottom
C13  121.75,150.88 270 bottom
C15  100.12,145.5 0 bottom
C16  105.5,125.12 270 bottom
C25  30.38,176.38 0 bottom
C26  30.38,177.62 0 bottom
C27  39.75,61.75 180 bottom
C28  39.75,36.75 180 bottom
C29  64.88,74.25 180 bottom
C30  64.75,49.25 180 bottom
C31  64.75,24.25 180 bottom
C32  89.75,74.25 180 bottom
C33  89.75,49.25 180 bottom
C34  89.75,24.25 180 bottom
C35  114.88,74.25 180 bottom
C36  114.88,49.25 180 bottom
C37  114.88,24.25 180 bottom
C38  139.88,74.25 180 bottom
C39  139.88,49.25 180 bottom
C40  139.88,24.25 180 bottom
C41  164.88,61.75 180 bottom
C42  164.88,36.75 180 bottom
C43  60.75,133.12 270 bottom
C44  59.5,133.12 270 bottom
C45  39.25,133 270 bottom
C46  51.62,124.12 90 bottom
CN1  69,128 0 bottom
CN2  7,174 0 bottom
CN3  18,143 180 bottom
CN4  153,93 90 top
D1  51.62,128.75 270 bottom
FB2  16.25,180.88 180 bottom
L1  43.38,134.88 180 bottom
MECH1  3,3 0 top
MECH2  3,93 0 top
MECH3  3,183 0 top
MECH4  93,3 0 top
MECH5  93,93 0 top
MECH6  93,183 0 top
MECH7  183,3 0 top
MECH8  183,93 0 top
MECH9  183,183 0 top
R1  125.88,134.75 180 bottom
R2  118.75,150.88 270 bottom
R3  39.75,63 0 bottom
R4  39.75,38 0 bottom
R5  64.88,75.5 0 bottom
R6  64.75,50.5 0 bottom
R7  64.75,25.5 0 bottom
R8  89.75,75.5 0 bottom
R9  89.75,50.5 0 bottom
R10  89.75,25.5 0 bottom
R11  114.88,75.5 0 bottom
R12  114.88,50.5 0 bottom
R13  114.88,25.5 0 bottom
R14  139.88,75.5 0 bottom
R15  139.88,50.5 0 bottom
R16  139.88,25.5 0 bottom
R17  164.88,63 0 bottom
R18  164.88,38 0 bottom
R19  48.62,127.75 270 bottom
R20  41.25,128 0 bottom
R21  120,150.88 90 bottom
SW1  30.5,60.5 0 top
SW2  30.5,35.5 0 top
SW3  55.5,73 0 top
SW4  55.5,48 0 top
SW5  55.5,23 0 top
SW6  80.5,73 0 top
SW7  80.5,48 0 top
SW8  80.5,23 0 top
SW9  105.5,73 0 top
SW10  105.5,48 0 top
SW11  105.5,23 0 top
SW12  130.5,73 0 top
SW13  130.5,48 0 top
SW14  130.5,23 0 top
SW15  155.5,60.5 0 top
SW16  155.5,35.5 0 top
U1  113,138 0 bottom
U3  42,130.12 90 bottom
U4  17,183 90 bottom
U5  25.5,176 180 bottom
U6  173,128 180 bottom

### Tracks (layer width: path | path; a pad name or v marks a point on that pad's centre or on a via)
3V3  (via drill 0.3, 0.5)
  Bottom 0.15: R1.2 v127.62,134.75
  Bottom 0.25: CN1.4 60.75,131.75 | U1.30 v124.62,132.25 | U1.33 U1.32 C3.2 v125.62,131.75 | U1.6 C1.2 v125.75,144.25 | U1.17 C2.2 v125.62,139.25 | U1.39 C4.2 v121.25,125.38 | U1.52 C5.2 v114.75,125.38 | U1.62 C6.2 v109.75,125.38 | U1.72 C7.2 v103.75,125.38 | U1.84 C8.2 v100.38,134.25 | U1.95 C9.2 v100.38,139.75 | U1.108 C10.2 v100.38,147.25 | U1.121 C11.2 v109.75,150.62 | U1.131 C12.2 v114.75,150.62 | U1.143 U1.144 C13.2 v121.25,150.62
  Bottom 0.5: 60.75,131.75 C43.2 C44.2 v58.38,132.38 v57.62,132.38 | 41.12,132.62 L1.1 | U3.5 40.7,132.2 40.75,132.25 | C45.2 v38.12,132.25 v38.12,131.12 v39.25,131.12 C45.2
  Bottom 0.8: C45.2 40.75,132.25 41.12,132.62
  pour 3V3: -7,-7 193,-7 193,193 -7,193
ADC_!DRDY  (via drill 0.3)
  Top 0.15: v131.5,133.75 v131.5,89.5 | v151.75,89.5 151.75,91.71 CN4.5
  Bottom 0.15: U1.27 v131.5,133.75 | v131.5,89.5 v151.75,89.5
ADC_SPI_!CS  (via drill 0.3)
  Top 0.15: v112.25,149.75 v112.25,162.5 | v165.25,162.5 v165.25,100.5 | CN4.15 154.25,94.29 v154.25,100.5
  Bottom 0.15: U1.125 v112.25,149.75 | v112.25,162.5 v165.25,162.5 | v165.25,100.5 v154.25,100.5
ADC_SPI_MISO  (via drill 0.3)
  Top 0.15: v111.75,150.12 v111.75,163 | v164.75,163 v164.75,100
  Bottom 0.15: U1.124 v111.75,150.12 | v111.75,163 v164.75,163 | v164.75,100 155.25,100 150.44,95.19 150.44,93.38 150.44,93.31 150.44,92.98 CN4.4
ADC_SPI_MOSI  (via drill 0.3)
  Top 0.15: v118.75,128.38 v118.75,108.75 | CN4.3 145.38,93 v145.38,108.75
  Bottom 0.15: U1.43 v118.75,128.38 | v118.75,108.75 v145.38,108.75
ADC_SPI_SCLK  (via drill 0.3)
  Top 0.15: v119.75,128.38 v119.75,109.25 | CN4.6 155.5,92.96 v155.5,109.25
  Bottom 0.15: U1.41 v119.75,128.38 | v119.75,109.25 v155.5,109.25
BTN_0  (via drill 0.3)
  Top 0.15: v140.62,26.5 128.62,38.5 v128.62,142.75
  Bottom 0.15: C40.2 R16.1 v140.62,26.5 | U1.9 v128.62,142.75
BTN_1  (via drill 0.3)
  Top 0.15: v65.5,26.5 68.38,29.38 68.38,78.25 74.75,84.62 120.88,84.62 124.75,88.5 v124.75,105.75 | v100.25,132.75 v100.25,105.75
  Bottom 0.15: C31.2 R7.1 v65.5,26.5 | U1.80 v100.25,132.75 | v100.25,105.75 v124.75,105.75
BTN_2  (via drill 0.3)
  Top 0.15: v90.5,26.5 95.88,31.88 95.88,80.88 98.5,83.5 121.25,83.5 126.25,88.5 v126.25,136.75 | v120.25,152.5 v120.25,158.5 | v131.5,158.5 v131.5,136.75
  Bottom 0.15: C34.2 R10.1 v90.5,26.5 | U1.21 v126.25,136.75 v131.5,136.75 | R21.2 120.25,151.88 v120.25,152.5 | v120.25,158.5 v131.5,158.5
BTN_3  (via drill 0.3)
  Top 0.15: v115.62,26.5 128.12,39 v128.12,137.75
  Bottom 0.15: C37.2 R13.1 v115.62,26.5 | U1.19 v128.12,137.75
BTN_4  (via drill 0.3)
  Top 0.15: v65.5,51.5 68,54 68,78.38 74.62,85 120.75,85 124.25,88.5 v124.25,105.25 | v99.75,133.25 v99.75,105.25
  Bottom 0.15: C30.2 R6.1 v65.5,51.5 | U1.81 v99.75,133.25 | v99.75,105.25 v124.25,105.25
BTN_5  (via drill 0.3)
  Top 0.15: v90.5,51.5 95.5,56.5 95.5,81 98.38,83.88 121.12,83.88 125.75,88.5 v125.75,106.75 | v101.25,129.25 v101.25,106.75
  Bottom 0.15: C33.2 R9.1 v90.5,51.5 | U1.73 v101.25,129.25 | v101.25,106.75 v125.75,106.75
BTN_6  (via drill 0.3)
  Top 0.15: v115.62,51.5 127.25,63.12 v127.25,108.25 | v118.25,128.75 v118.25,108.25
  Bottom 0.15: C36.2 R12.1 v115.62,51.5 | U1.44 v118.25,128.75 | v118.25,108.25 v127.25,108.25
BTN_7  (via drill 0.3)
  Top 0.15: v65.62,76.5 74.5,85.38 120.62,85.38 123.75,88.5 v123.75,104.75 | v99.25,133.75 v99.25,104.75
  Bottom 0.15: C29.2 R5.1 v65.62,76.5 | U1.82 v99.25,133.75 | v99.25,104.75 v123.75,104.75
BTN_8  (via drill 0.3)
  Top 0.15: v90.5,76.5 98.25,84.25 121,84.25 125.25,88.5 v125.25,106.25 | v100.75,129.75 v100.75,106.25
  Bottom 0.15: C32.2 R8.1 v90.5,76.5 | U1.74 v100.75,129.75 | v100.75,106.25 v125.25,106.25
BTN_9  (via drill 0.3)
  Top 0.15: v115.62,73.25 125.5,73.25 126.75,74.5 v126.75,137.25
  Bottom 0.15: R11.1 C35.2 v115.62,73.25 | U1.20 v126.75,137.25
BTN_AMPS  (via drill 0.3)
  Top 0.15: v165.62,64 164.75,64.88 154.5,64.88 131,88.38 131,88.62 131,88.75 131,89.25 131,89.38 v131,143.75
  Bottom 0.15: C41.2 R17.1 v165.62,64 | U1.7 124.38,143.75 124.5,143.62 127.38,143.62 127.5,143.75 v131,143.75
BTN_CANCEL  (via drill 0.3)
  Top 0.15: v140.62,76.5 140.62,77.75 130,88.38 v130,143.25
  Bottom 0.15: C38.2 R14.1 v140.62,76.5 | U1.8 v130,143.25
BTN_DP  (via drill 0.3)
  Top 0.15: v140.62,51.5 129.12,63 v129.12,107.75 | v117.75,128.38 v117.75,107.75
  Bottom 0.15: C39.2 R15.1 v140.62,51.5 | U1.45 v117.75,128.38 | v117.75,107.75 v129.12,107.75
BTN_ON0FF  (via drill 0.3)
  Top 0.15: v40.5,64 42.25,65.75 42.25,79.5 48.88,86.12 120.38,86.12 122.75,88.5 v122.75,103.75 | v97.75,136.75 v97.75,103.75
  Bottom 0.15: C27.2 R3.1 v40.5,64 | U1.88 v97.75,136.75 | v97.75,103.75 v122.75,103.75
BTN_OUT_CONT  (via drill 0.3)
  Top 0.15: v40.5,39 42.62,41.12 42.62,79.38 49,85.75 120.5,85.75 123.25,88.5 v123.25,104.25 | v98.75,136.25 v98.75,104.25
  Bottom 0.15: C28.2 R4.1 v40.5,39 | U1.87 v98.75,136.25 | v98.75,104.25 v123.25,104.25
BTN_VOLTS  (via drill 0.3)
  Top 0.15: v165.62,39 144.38,60.25 144.38,74.5 130.5,88.38 v130.5,107.25 | v116.25,128.75 v116.25,107.25
  Bottom 0.15: C42.2 R18.1 v165.62,39 | U1.48 v116.25,128.75 | v116.25,107.25 v130.5,107.25
DAC_I2C_SCL  (via drill 0.3)
  Top 0.15: v117.75,147.25 v117.75,162 | v165.75,162 v165.75,101
  Bottom 0.15: U1.136 v117.75,147.25 | v117.75,162 v165.75,162 | v165.75,101 151.5,101 148.12,97.62 148.12,95.33 CN4.17
DAC_I2C_SDA  (via drill 0.3)
  Top 0.15: v118.25,147.62 v118.25,161.5 | v166.25,161.5 v166.25,101.5
  Bottom 0.15: U1.137 v118.25,147.62 | v118.25,161.5 v166.25,161.5 | v166.25,101.5 151.5,101.5 147.75,97.75 147.75,95.37 CN4.18
DISP_B0  (via drill 0.3)
  Top 0.15: v129,145.75 v129,160.5 | v69.25,132.5 v69.25,160.5
  Bottom 0.15: U1.3 v129,145.75 | v129,160.5 v69.25,160.5 | CN1.21 v69.25,132.5
DISP_B1  (via drill 0.3)
  Top 0.15: v113.25,149.75 v113.25,155.5 | v69.75,132 v69.75,155.5
  Bottom 0.15: U1.127 v113.25,149.75 | v113.25,155.5 v69.75,155.5 | CN1.22 v69.75,132
DISP_B2  (via drill 0.3)
  Top 0.15: v110.75,147.62 v110.75,153 | v70.25,132.5 v70.25,153
  Bottom 0.15: U1.122 v110.75,147.62 | v110.75,153 v70.25,153 | CN1.23 v70.25,132.5
DISP_B3  (via drill 0.3)
  Top 0.15: v70.75,142.75 v70.75,132
  Bottom 0.15: U1.100 v70.75,142.75 | v70.75,132 CN1.24
DISP_B4  (via drill 0.3)
  Top 0.15: v71.25,132.5 v71.25,143.75
  Bottom 0.15: U1.102 v71.25,143.75 | CN1.25 v71.25,132.5
DISP_B5  (via drill 0.3)
  Top 0.15: v121.75,126.25 v121.75,113.25 | v71.75,132 v71.75,113.25
  Bottom 0.15: U1.37 v121.75,126.25 | v121.75,113.25 v71.75,113.25 | CN1.26 v71.75,132
DISP_B6  (via drill 0.3)
  Top 0.15: v119.25,147.62 v119.25,158.5 | v72.25,132.5 v72.25,158.5
  Bottom 0.15: U1.139 v119.25,147.62 | v119.25,158.5 v72.25,158.5 | CN1.27 v72.25,132.5
DISP_B7  (via drill 0.3)
  Top 0.15: v119.75,147.25 v119.75,159 | v72.75,132.88 v72.75,159
  Bottom 0.15: U1.140 v119.75,147.25 | v119.75,159 v72.75,159 | CN1.28 v72.75,132.88
DISP_CLK  (via drill 0.3)
  Top 0.15: v73.75,138.75 v73.75,132.88
  Bottom 0.15: U1.92 v73.75,138.75 | v73.75,132.88 CN1.30
DISP_DE  (via drill 0.3)
  Top 0.15: v129.5,136.25 v129.5,161 | v75.75,132 v75.75,161
  Bottom 0.15: U1.22 v129.5,136.25 | v129.5,161 v75.75,161 | CN1.34 v75.75,132
DISP_EN  (via drill 0.3)
  Top 0.15: v74.25,141.75 v74.25,132.5
  Bottom 0.15: U1.98 v74.25,141.75 | v74.25,132.5 CN1.31
DISP_G0  (via drill 0.3)
  Top 0.15: v128.5,160 v128.5,145.25 | v65.25,132.38 v65.25,160
  Bottom 0.15: U1.4 v128.5,145.25 | v128.5,160 v65.25,160 | CN1.13 v65.25,132.38
DISP_G1  (via drill 0.3)
  Top 0.15: v128,159.5 v128,144.75 | v65.75,132 v65.75,159.5
  Bottom 0.15: U1.5 124.5,144.75 124.62,144.88 127.88,144.88 v128,144.75 | v128,159.5 v65.75,159.5 | CN1.14 v65.75,132
DISP_G2  (via drill 0.3)
  Top 0.15: v119.25,128.75 v119.25,112.25 | v66.25,132.38 v66.25,112.25
  Bottom 0.15: U1.42 v119.25,128.75 | v119.25,112.25 v66.25,112.25 | CN1.15 v66.25,132.38
DISP_G3  (via drill 0.3)
  Top 0.15: v66.75,132 v66.75,142.25
  Bottom 0.15: U1.99 v66.75,142.25 | CN1.16 v66.75,132
DISP_G4  (via drill 0.3)
  Top 0.15: v105.75,128.38 v105.75,121.62 | v67.25,132.5 v67.25,121.62
  Bottom 0.15: U1.69 v105.75,128.38 | v105.75,121.62 v67.25,121.62 | CN1.17 v67.25,132.5
DISP_G5  (via drill 0.3)
  Top 0.15: v105.25,128.75 v105.25,121.12 | v67.75,132 v67.75,121.12
  Bottom 0.15: U1.70 v105.25,128.75 | v105.25,121.12 v67.75,121.12 | CN1.18 v67.75,132
DISP_G6  (via drill 0.3)
  Top 0.15: v68.25,141.25 v68.25,132.5
  Bottom 0.15: U1.97 v68.25,141.25 | v68.25,132.5 CN1.19
DISP_G7  (via drill 0.3)
  Top 0.15: v68.75,132 v68.75,152.5 | v108.25,152.5 v108.25,149.75
  Bottom 0.15: CN1.20 v68.75,132 | v108.25,149.75 U1.117 | v68.75,152.5 v108.25,152.5
DISP_HSD  (via drill 0.3)
  Top 0.15: v74.75,132 v74.75,140.75
  Bottom 0.15: U1.96 101.5,140.75 101.38,140.88 98.75,140.88 98.62,140.75 v74.75,140.75 | CN1.32 v74.75,132
DISP_LED+
  Bottom 0.25: CN1.2 59.75,129.75 59.5,129.5
  Bottom 0.5: D1.K C46.2 53.38,124.88 58,129.5 59.5,129.5
DISP_LED-
  Bottom 0.15: R19.2 48.55,129.18 U3.3
  Bottom 0.25: CN1.1 59.12,130.75
  Bottom 0.5: R19.2 55.25,129.25 56.75,130.75 59.12,130.75
DISP_PWM  (via drill 0.3)
  Top 0.15: v125.75,130.25 v125.75,111.75 | v40.5,111.75 v40.5,127
  Bottom 0.15: U3.4 40.5,128.97 R20.2 v40.5,127 | U1.34 v125.75,130.25 | v125.75,111.75 v40.5,111.75
DISP_R0  (via drill 0.3)
  Top 0.15: v113.75,150.12 v113.75,158 | v61.38,135.5 v61.38,158
  Bottom 0.15: U1.128 v113.75,150.12 | v113.75,158 v61.38,158 | CN1.5 61.25,131.62 61.38,131.75 v61.38,135.5
DISP_R1  (via drill 0.3)
  Top 0.15: v125.25,129.25 v125.25,109.75 | v61.75,129.5 v61.75,109.75
  Bottom 0.15: U1.36 v125.25,129.25 | v125.25,109.75 v61.75,109.75 | CN1.6 v61.75,129.5
DISP_R2  (via drill 0.3)
  Top 0.15: v124.75,129.75 v124.75,110.25 | v62.25,132.38 v62.25,110.25
  Bottom 0.15: U1.35 v124.75,129.75 | v124.75,110.25 v62.25,110.25 | CN1.7 v62.25,132.38
DISP_R3  (via drill 0.3)
  Top 0.15: v117.25,128.75 v117.25,111.25 | v62.75,132 v62.75,111.25
  Bottom 0.15: U1.46 v117.25,128.75 | v117.25,111.25 v62.75,111.25 | CN1.8 v62.75,132
DISP_R4  (via drill 0.3)
  Top 0.15: v63.25,132.38 v63.25,144.25
  Bottom 0.15: U1.103 v63.25,144.25 | CN1.9 v63.25,132.38
DISP_R5  (via drill 0.3)
  Top 0.15: v63.75,132 v63.75,143.25
  Bottom 0.15: U1.101 v63.75,143.25 | CN1.10 v63.75,132
DISP_R6  (via drill 0.3)
  Top 0.15: v116.75,128.38 v116.75,110.75 | v64.25,132.38 v64.25,110.75
  Bottom 0.15: U1.47 v116.75,128.38 | v116.75,110.75 v64.25,110.75 | CN1.11 v64.25,132.38
DISP_R7  (via drill 0.3)
  Top 0.15: v64.75,132 v64.75,138.25
  Bottom 0.15: U1.91 v64.75,138.25 | CN1.12 v64.75,132
DISP_VSD  (via drill 0.3)
  Top 0.15: v120.25,128.75 v120.25,112.75 | v75.25,132.5 v75.25,112.75
  Bottom 0.15: U1.40 v120.25,128.75 | v120.25,112.75 v75.25,112.75 | CN1.33 v75.25,132.5
FT_3V3_BUS  (via drill 0.3)
  Bottom 0.15: U5.3 24.53,175.03 26.47,176.97 U5.11 U5.10 C26.2 v29.62,178.62
FT_UART_RX  (via drill 0.3)
  Top 0.15: v88,130.25 v88,164.5 | v24.12,175.62 v24.12,164.5
  Bottom 0.15: U1.75 v88,130.25 | v88,164.5 v24.12,164.5 | U5.4 24.08,175.68 v24.12,175.62
FT_UART_TX  (via drill 0.3)
  Top 0.15: v88.5,130.75 v88.5,165 | v22.75,165 v22.75,173.12
  Bottom 0.15: U1.76 v88.5,130.75 | v88.5,165 v22.75,165 | v22.75,173.12 U5.1
GND  (via drill 0.3, 0.5, 1)
  Bottom 0.15: R2.1 v118.75,152.62 | R20.1 v43,128 | C26.1 v32.12,177.62 | C25.1 v32.12,176.38 | U5.13 27.42,175.68 v27.38,175.62 | U5.5 23.55,176.32 v23.62,176.25 | U5.6 23.6,176.97 v23.62,177 | C41.1 v164.12,60.75 | C42.1 v164.12,35.75 | C40.1 v139.12,23.25 | C39.1 v139.12,48.25 | C38.1 v139.12,73.25 | C37.1 v114.12,23.25 | C36.1 v114.12,48.25 | C35.1 v114.12,73.25 | C32.1 v89,73.25 | C33.1 v89,48.25 | C34.1 v89,23.25 | C31.1 v64,23.25 | C30.1 v64,48.25 | C29.1 v64.12,73.25 | C27.1 v39,60.75 | C28.1 v39,35.75
  Bottom 0.25: v76.75,132.5 v76.75,131.88 CN1.36 v76.75,129.62 v76.75,129 | v60.25,127.75 v60.25,128.38 CN1.3 v60.25,129.62 v60.25,129 | U1.16 v122.62,139.25 | U1.31 v122.62,131.75 | C1.1 v127.62,144.25 | C2.1 v127.62,138.75 | C3.1 v127.62,131.25 | U1.38 v121.25,128.38 | U1.51 v114.75,128.38 | C5.1 v114.25,123.38 | U1.61 v109.75,128.38 | C6.1 v109.25,123.38 | C7.1 v103.25,124.38 | U1.83 v103.38,134.25 | C8.1 v98.25,134.75 | U1.94 v103.38,139.75 | C9.1 v98.38,140.25 | U1.107 v103.38,146.25 | C10.1 v98.38,146.75 | U1.120 v109.75,147.62 | C11.1 v109.25,151.62 | U1.130 v114.75,147.62 | C12.1 v115.25,152.62 | C13.1 v121.75,152.62 | C15.2 v98.38,145.5 | C16.2 104.75,123.62 v104.75,123.38 | v73.25,132.5 v73.25,131.88 CN1.29 v73.25,129.62 v73.25,129 | C4.1 v120.75,123.38 | U4.2 v19.5,183
  Bottom 0.5: C43.1 v60.75,135 | C44.1 v59.5,135 | v50.5,123.38 C46.1 v52.75,123.38 | R19.1 v48.62,127.25 | R19.1 v47.25,126.25 | R19.1 v50,126.25 | R19.1 v48.62,125.25 | v44.38,130.12 U3.2 v42.25,130.12 | CN2.GND 5.4,178.35 v5.38,178.38 | C45.1 v39.25,134.88 v38.12,134.88 v38.12,133.75 C45.1
  other vias: 2.5,176.5 2.5,171.25 11.5,171.25 11.5,176.5
  pour GND: -7,-7 193,-7 193,193 -7,193
  pour Top: -7,-7 193,-7 193,193 -7,193
  pour Bottom: -7,-7 193,-7 193,193 -7,193
JTAG_TCK  (via drill 0.3)
  Top 0.15: v25.5,149.12 v25.5,140.38
  Bottom 0.15: U1.109 104.25,149.12 v25.5,149.12 | v25.5,140.38 18.08,140.38 CN3.5
JTAG_TDI  (via drill 0.3)
  Top 0.15: v25,149.62 v25,135.38
  Bottom 0.15: U1.110 104.75,149.38 104.5,149.62 v25,149.62 | CN3.3 18,135.38 v25,135.38
JTAG_TDO  (via drill 0.3)
  Top 0.15: v116.25,147.25 v116.25,153.5 | v24.5,153.5 v24.5,145.62
  Bottom 0.15: U1.133 v116.25,147.25 | v116.25,153.5 v24.5,153.5 | v24.5,145.62 17.92,145.62 CN3.7
JTAG_TMS  (via drill 0.3)
  Top 0.15: v103.38,145.25 100.62,145.25 v100.12,144.75 | v24.5,144.75 v24.5,137.88
  Bottom 0.15: U1.105 v103.38,145.25 | v100.12,144.75 v24.5,144.75 | v24.5,137.88 18.05,137.88 CN3.4
JTAG_TRST  (via drill 0.3)
  Top 0.15: v116.75,147.62 v116.75,163.5 | v60.88,163.5 v60.88,150.12 | v24,132.88 v24,150.12
  Bottom 0.15: U1.134 v116.75,147.62 | v116.75,163.5 v60.88,163.5 | v60.88,150.12 v24,150.12 | CN3.2 17.97,132.88 v24,132.88
N$1
  Bottom 0.25: U1.71 104.75,126.62 C16.1
N$2
  Bottom 0.25: U1.106 101.12,145.75 C15.1
N$41
  Bottom 0.25: U4.4 14.45,182.05 13.75,182.75 9.38,182.75 7.62,181 7.62,178.25 7.8,178.07 CN2.D-
N$42
  Bottom 0.25: U4.6 14.45,183.95 13.75,183.25 9.12,183.25 7.12,181.25 7.12,176.93 CN2.D+
N$43
  Bottom 0.25: U4.3 19.67,182.05 20.38,182.75 24.62,182.75 25.25,182.12 25.25,178.88 25.85,178.28 U5.9
N$44  (via drill 0.3)
  Top 0.25: v25.88,179.12 v25,178.25
  Bottom 0.25: U4.1 19.67,183.95 20.38,183.25 24.88,183.25 25.75,182.38 25.75,179.12 v25.88,179.12 | v25,178.25 24.97,178.28 U5.8
N$45
  Bottom 0.5: CN2.VCC 8.6,178.85 10.62,180.88 FB2.1
N$46  (via drill 0.5)
  Top 0.5: v22.75,179.38 25.75,176.38 28.5,176.38 v29.62,175.25
  Bottom 0.15: C25.2 29.58,176.32 U5.12
  Bottom 0.5: U4.5 17,183 FB2.2 21.25,180.88 v22.75,179.38 | C25.2 v29.62,175.25
N$48  (1 unrouted)
  Bottom 0.15: R3.2 36.75,63 SW1.4
N$50  (1 unrouted)
  Bottom 0.15: R4.2 36.75,38 SW2.4
N$52  (1 unrouted)
  Bottom 0.15: R5.2 61.75,75.5 SW3.4
N$54  (1 unrouted)
  Bottom 0.15: R6.2 61.75,50.5 SW4.4
N$56  (1 unrouted)
  Bottom 0.15: R7.2 61.75,25.5 SW5.4
N$58  (1 unrouted)
  Bottom 0.15: R8.2 86.75,75.5 SW6.4
N$60  (1 unrouted)
  Bottom 0.15: R9.2 86.75,50.5 SW7.4
N$62  (1 unrouted)
  Bottom 0.15: R10.2 86.75,25.5 SW8.4
N$64  (1 unrouted)
  Bottom 0.15: R11.2 111.75,75.5 SW9.4
N$66  (1 unrouted)
  Bottom 0.15: SW10.4 111.75,50.5 R12.2
N$68  (1 unrouted)
  Bottom 0.15: SW11.4 111.75,25.5 R13.2
N$70  (1 unrouted)
  Bottom 0.15: SW12.4 136.75,75.5 R14.2
N$72  (1 unrouted)
  Bottom 0.15: SW13.4 136.75,50.5 R15.2
N$74  (1 unrouted)
  Bottom 0.15: SW14.4 136.75,25.5 R16.2
N$76  (1 unrouted)
  Bottom 0.15: R17.2 161.75,63 SW15.4
N$78  (1 unrouted)
  Bottom 0.15: R18.2 161.75,38 SW16.4
N$79
  Top 0.15: 37.65,98 32.65,98 32.65,103
N$80
  Top 0.15: 32.65,168.86 32.65,173.86 37.65,173.86
N$81
  Top 0.15: 148.35,173.86 153.35,173.86 153.35,168.86
N$82
  Top 0.15: 153.35,103 153.35,98 148.35,98
N$86
  Bottom 0.5: U3.1 43.83,131.07 45.62,132.88 45.62,134.62 L1.2
  Bottom 1.4: D1.A 51.62,133.12 48.5,136.25 45.62,136.25 45.62,134.62
OUTPUT_RELAY_EN  (via drill 0.3)
  Top 0.15: v136,138.25 136,112 137.38,110.62 145,110.62 146.38,109.25 146.38,97.38 147.25,96.5 149.5,96.5 CN4.16
  Bottom 0.15: U1.18 124.38,138.25 124.5,138.12 127.25,138.12 127.38,138.25 v136,138.25
PGND
  Top 1: CN4.12 CN4.11 164.43,93 CN4.10 162.62,91.73 | 162.62,91.73 CN4.9 CN4.12 | CN4.12 162.62,93.53 162.62,91.73
  Top 3.5: U6.1 175.54,99.92 168.62,93 164.43,93
SDRAM_!CAS  (via drill 0.3)
  Top 0.15: v149.5,135.5 v149.5,155.5 | v115.75,155.5 v115.75,147.62
  Bottom 0.15: 149.6,135.6 v149.5,135.5 | v149.5,155.5 v115.75,155.5 | v115.75,147.62 U1.132
SDRAM_!CS  (via drill 0.3)
  Top 0.15: v147.25,134 v147.25,124 | v135.5,124 v135.5,133.25
  Bottom 0.15: v147.25,124 v135.5,124 | v135.5,133.25 U1.28
SDRAM_!RAS  (via drill 0.3)
  Top 0.15: v146.75,134.75 v146.75,116.25 | v115.75,116.25 v115.75,128.38
  Bottom 0.15: 146.8,134.8 v146.75,134.75 | v146.75,116.25 v115.75,116.25 | v115.75,128.38 U1.49
SDRAM_!WE  (via drill 0.3)
  Top 0.15: v150,136.38 v150,151.88 | v130.5,151.88 v130.5,134.25
  Bottom 0.15: 150.03,136.4 v150,136.38 | v150,151.88 v130.5,151.88 | U1.26 124.38,134.25 124.5,134.12 127.25,134.12 127.38,134.25 v130.5,134.25
SDRAM_A0  (via drill 0.3)
  Top 0.15: v135,142.25 v135,126 | v149.25,126 v149.25,130.75
  Bottom 0.15: U1.10 v135,142.25 | v149.25,126 v135,126 | v149.25,130.75 149.3,130.8
SDRAM_A1  (via drill 0.3)
  Top 0.15: v149.75,125.5 v149.75,130 | v134.5,141.75 v134.5,125.5
  Bottom 0.15: U1.11 v134.5,141.75 | v134.5,125.5 v149.75,125.5
SDRAM_A2  (via drill 0.3)
  Top 0.15: v134,141.25 v134,125 | v150.25,125 v150.25,129.25
  Bottom 0.15: U1.12 v134,141.25 | v134,125 v150.25,125 | 150.3,129.2 v150.25,129.25
SDRAM_A3  (via drill 0.3)
  Top 0.15: v133.5,140.75 v133.5,124.5 | v150.75,124.5 v150.75,128.5
  Bottom 0.15: U1.13 v133.5,140.75 | v133.5,124.5 v150.75,124.5 | v150.75,128.5 150.85,128.4
SDRAM_A4  (via drill 0.3)
  Top 0.15: v133,128.38 v133,140.25
  Bottom 0.15: 133.03,128.4 v133,128.38 | v133,140.25 U1.14
SDRAM_A5  (via drill 0.3)
  Top 0.15: v132.5,129.25 v132.5,139.75
  Bottom 0.15: 132.55,129.2 v132.5,129.25 | v132.5,139.75 U1.15
SDRAM_A6  (via drill 0.3)
  Top 0.15: v115.25,128.75 v115.25,119.88 | v140.62,130 v140.62,119.88
  Bottom 0.15: U1.50 v115.25,128.75 | v140.62,119.88 v115.25,119.88
SDRAM_A7  (via drill 0.3)
  Top 0.15: v113.75,128.38 v113.75,120.38 | v140.12,130.75 v140.12,120.38
  Bottom 0.15: U1.53 v113.75,128.38 | 140.18,130.8 v140.12,130.75 | v140.12,120.38 v113.75,120.38
SDRAM_A8  (via drill 0.3)
  Top 0.15: v113.25,128.75 v113.25,120.88 | v139.62,131.62 v139.62,120.88
  Bottom 0.15: U1.54 v113.25,128.75 | 139.65,131.6 v139.62,131.62 | v139.62,120.88 v113.25,120.88
SDRAM_A9  (via drill 0.3)
  Top 0.15: v112.75,128.38 v112.75,121.38 | v139.12,132.38 v139.12,121.38
  Bottom 0.15: U1.55 v112.75,128.38 | 139.15,132.4 v139.12,132.38 | v139.12,121.38 v112.75,121.38
SDRAM_A10  (via drill 0.3)
  Top 0.15: v148.75,131.5 v148.75,117.75 | v112.25,117.75 v112.25,128.75
  Bottom 0.15: 148.85,131.6 v148.75,131.5 | v148.75,117.75 v112.25,117.75 | v112.25,128.75 U1.56
SDRAM_A11  (via drill 0.3)
  Top 0.15: v111.75,128.38 v111.75,121.88 | v138.62,133.25 v138.62,121.88
  Bottom 0.15: U1.57 v111.75,128.38 | 138.68,133.2 v138.62,133.25 | v138.62,121.88 v111.75,121.88
SDRAM_BA0  (via drill 0.3)
  Top 0.15: v147.75,133.25 v147.75,116.75 | v96.75,137.25 v96.75,116.75
  Bottom 0.15: 147.8,133.2 v147.75,133.25 | v147.75,116.75 v96.75,116.75 | v96.75,137.25 U1.89
SDRAM_BA1  (via drill 0.3)
  Top 0.15: v148.25,132.5 v148.25,117.25 | v97.25,137.75 v97.25,117.25
  Bottom 0.15: 148.35,132.4 v148.25,132.5 | v148.25,117.25 v97.25,117.25 | v97.25,137.75 U1.90
SDRAM_CKE  (via drill 0.3)
  Top 0.15: v129.12,134.75 v129.12,132.75
  Bottom 0.15: 141.95,134.75 v129.12,134.75 | v129.12,132.75 U1.29
SDRAM_CLK  (via drill 0.3)
  Top 0.15: v136.75,135.62 v136.75,113.75 | v96.25,139.25 v96.25,113.75
  Bottom 0.15: 136.78,135.6 v136.75,135.62 | v136.75,113.75 v96.25,113.75 | v96.25,139.25 U1.93
SDRAM_D0  (via drill 0.3)
  Top 0.15: v149,147.62 v149,157 | v90.5,157 v90.5,135.25
  Bottom 0.15: 149.03,147.6 v149,147.62 | v90.5,135.25 98.62,135.25 98.75,135.38 101.38,135.38 101.5,135.25 U1.85 | v149,157 v90.5,157
SDRAM_D1  (via drill 0.3)
  Top 0.15: v148.5,146 v148.5,157.5 | v91,157.5 v91,135.75
  Bottom 0.15: v148.5,157.5 v91,157.5 | v91,135.75 U1.86
SDRAM_D2  (via drill 0.3)
  Top 0.15: v151,145.25 v151,154 | v106.75,154 v106.75,150.12
  Bottom 0.15: 151.05,145.2 v151,145.25 | v151,154 v106.75,154 | v106.75,150.12 U1.114
SDRAM_D3  (via drill 0.3)
  Top 0.15: v150.5,143.62 v150.5,154.5 | v107.25,154.5 v107.25,149.75
  Bottom 0.15: 150.53,143.6 v150.5,143.62 | v107.25,149.75 U1.115 | v150.5,154.5 v107.25,154.5
SDRAM_D4  (via drill 0.3)
  Top 0.15: v151.25,142.75 v151.25,115.25 | v111.25,128.75 v111.25,115.25
  Bottom 0.15: U1.58 v111.25,128.75 | 151.3,142.8 v151.25,142.75 | v151.25,115.25 v111.25,115.25
SDRAM_D5  (via drill 0.3)
  Top 0.15: v151.75,141.12 v151.75,114.75 | v110.75,128.38 v110.75,114.75
  Bottom 0.15: U1.59 v110.75,128.38 | 151.82,141.2 v151.75,141.12 | v151.75,114.75 v110.75,114.75
SDRAM_D6  (via drill 0.3)
  Top 0.15: v152.25,140.38 v152.25,114.25 | v110.25,128.75 v110.25,114.25
  Bottom 0.15: v110.25,128.75 U1.60 | 152.28,140.4 v152.25,140.38 | v152.25,114.25 v110.25,114.25
SDRAM_D7  (via drill 0.3)
  Top 0.15: v146.25,138.75 v146.25,115.75 | v108.75,115.75 v108.75,128.38
  Bottom 0.15: 146.3,138.8 v146.25,138.75 | v146.25,115.75 v108.75,115.75 | v108.75,128.38 U1.63
SDRAM_D8  (via drill 0.3)
  Top 0.15: v108.25,128.75 v108.25,122.38 | v138.12,138.88 v138.12,122.38
  Bottom 0.15: U1.64 v108.25,128.75 | 138.2,138.8 v138.12,138.88 | v138.12,122.38 v108.25,122.38
SDRAM_D9  (via drill 0.3)
  Top 0.15: v107.75,128.38 v107.75,119.38 | v143.88,140.5 v143.88,119.38
  Bottom 0.15: U1.65 v107.75,128.38 | 143.78,140.4 v143.88,140.5 | v143.88,119.38 v107.75,119.38
SDRAM_D10  (via drill 0.3)
  Top 0.15: v107.25,128.75 v107.25,122.88 | v137.25,141.25 v137.25,122.88
  Bottom 0.15: U1.66 v107.25,128.75 | 137.3,141.2 v137.25,141.25 | v137.25,122.88 v107.25,122.88
SDRAM_D11  (via drill 0.3)
  Top 0.15: v106.75,128.38 v106.75,118.88 | v144.38,142.75 v144.38,118.88
  Bottom 0.15: U1.67 v106.75,128.38 | 144.32,142.8 v144.38,142.75 | v144.38,118.88 v106.75,118.88
SDRAM_D12  (via drill 0.3)
  Top 0.15: v144.88,143.62 v144.88,118.38 | v106.25,118.38 v106.25,128.75
  Bottom 0.15: U1.68 v106.25,128.75 | 144.85,143.6 v144.88,143.62 | v144.88,118.38 v106.25,118.38
SDRAM_D13  (via drill 0.3)
  Top 0.15: v144,145.25 v144,156 | v89,156 v89,131.25
  Bottom 0.15: 143.95,145.2 v144,145.25 | v144,156 v89,156 | v89,131.25 U1.77
SDRAM_D14  (via drill 0.3)
  Top 0.15: v145,146 v145,155 | v90,155 v90,131.75
  Bottom 0.15: v145,155 v90,155 | v90,131.75 U1.78
SDRAM_D15  (via drill 0.3)
  Top 0.15: v144.5,147.62 v144.5,156.5 | v89.5,156.5 v89.5,132.25
  Bottom 0.15: 144.47,147.6 v144.5,147.62 | v144.5,156.5 v89.5,156.5 | v89.5,132.25 U1.79
STM_BOOT0
  Bottom 0.15: U1.138 R2.2 R21.1
STM_NRST  (via drill 0.3)
  Top 0.15: v125.12,164 v125.12,135.75 | v60.38,164 v60.38,148.12
  Bottom 0.15: v125.12,164 v60.38,164 | U1.25 R1.1 v125.12,135.75 | CN3.8 17.95,148.12 v60.38,148.12
VIN
  Top 1: CN4.8 CN4.13 158.12,94.27 CN4.14 156.81,92.5 | CN4.8 CN4.7 156.81,92.5 | CN4.8 158.58,92.5 156.81,92.5
  Top 3.5: U6.2 170.46,101.09 167,97.62 159.75,97.62 158.12,96 158.12,94.27